# Altium project 7797-20-0224.PrjPcb
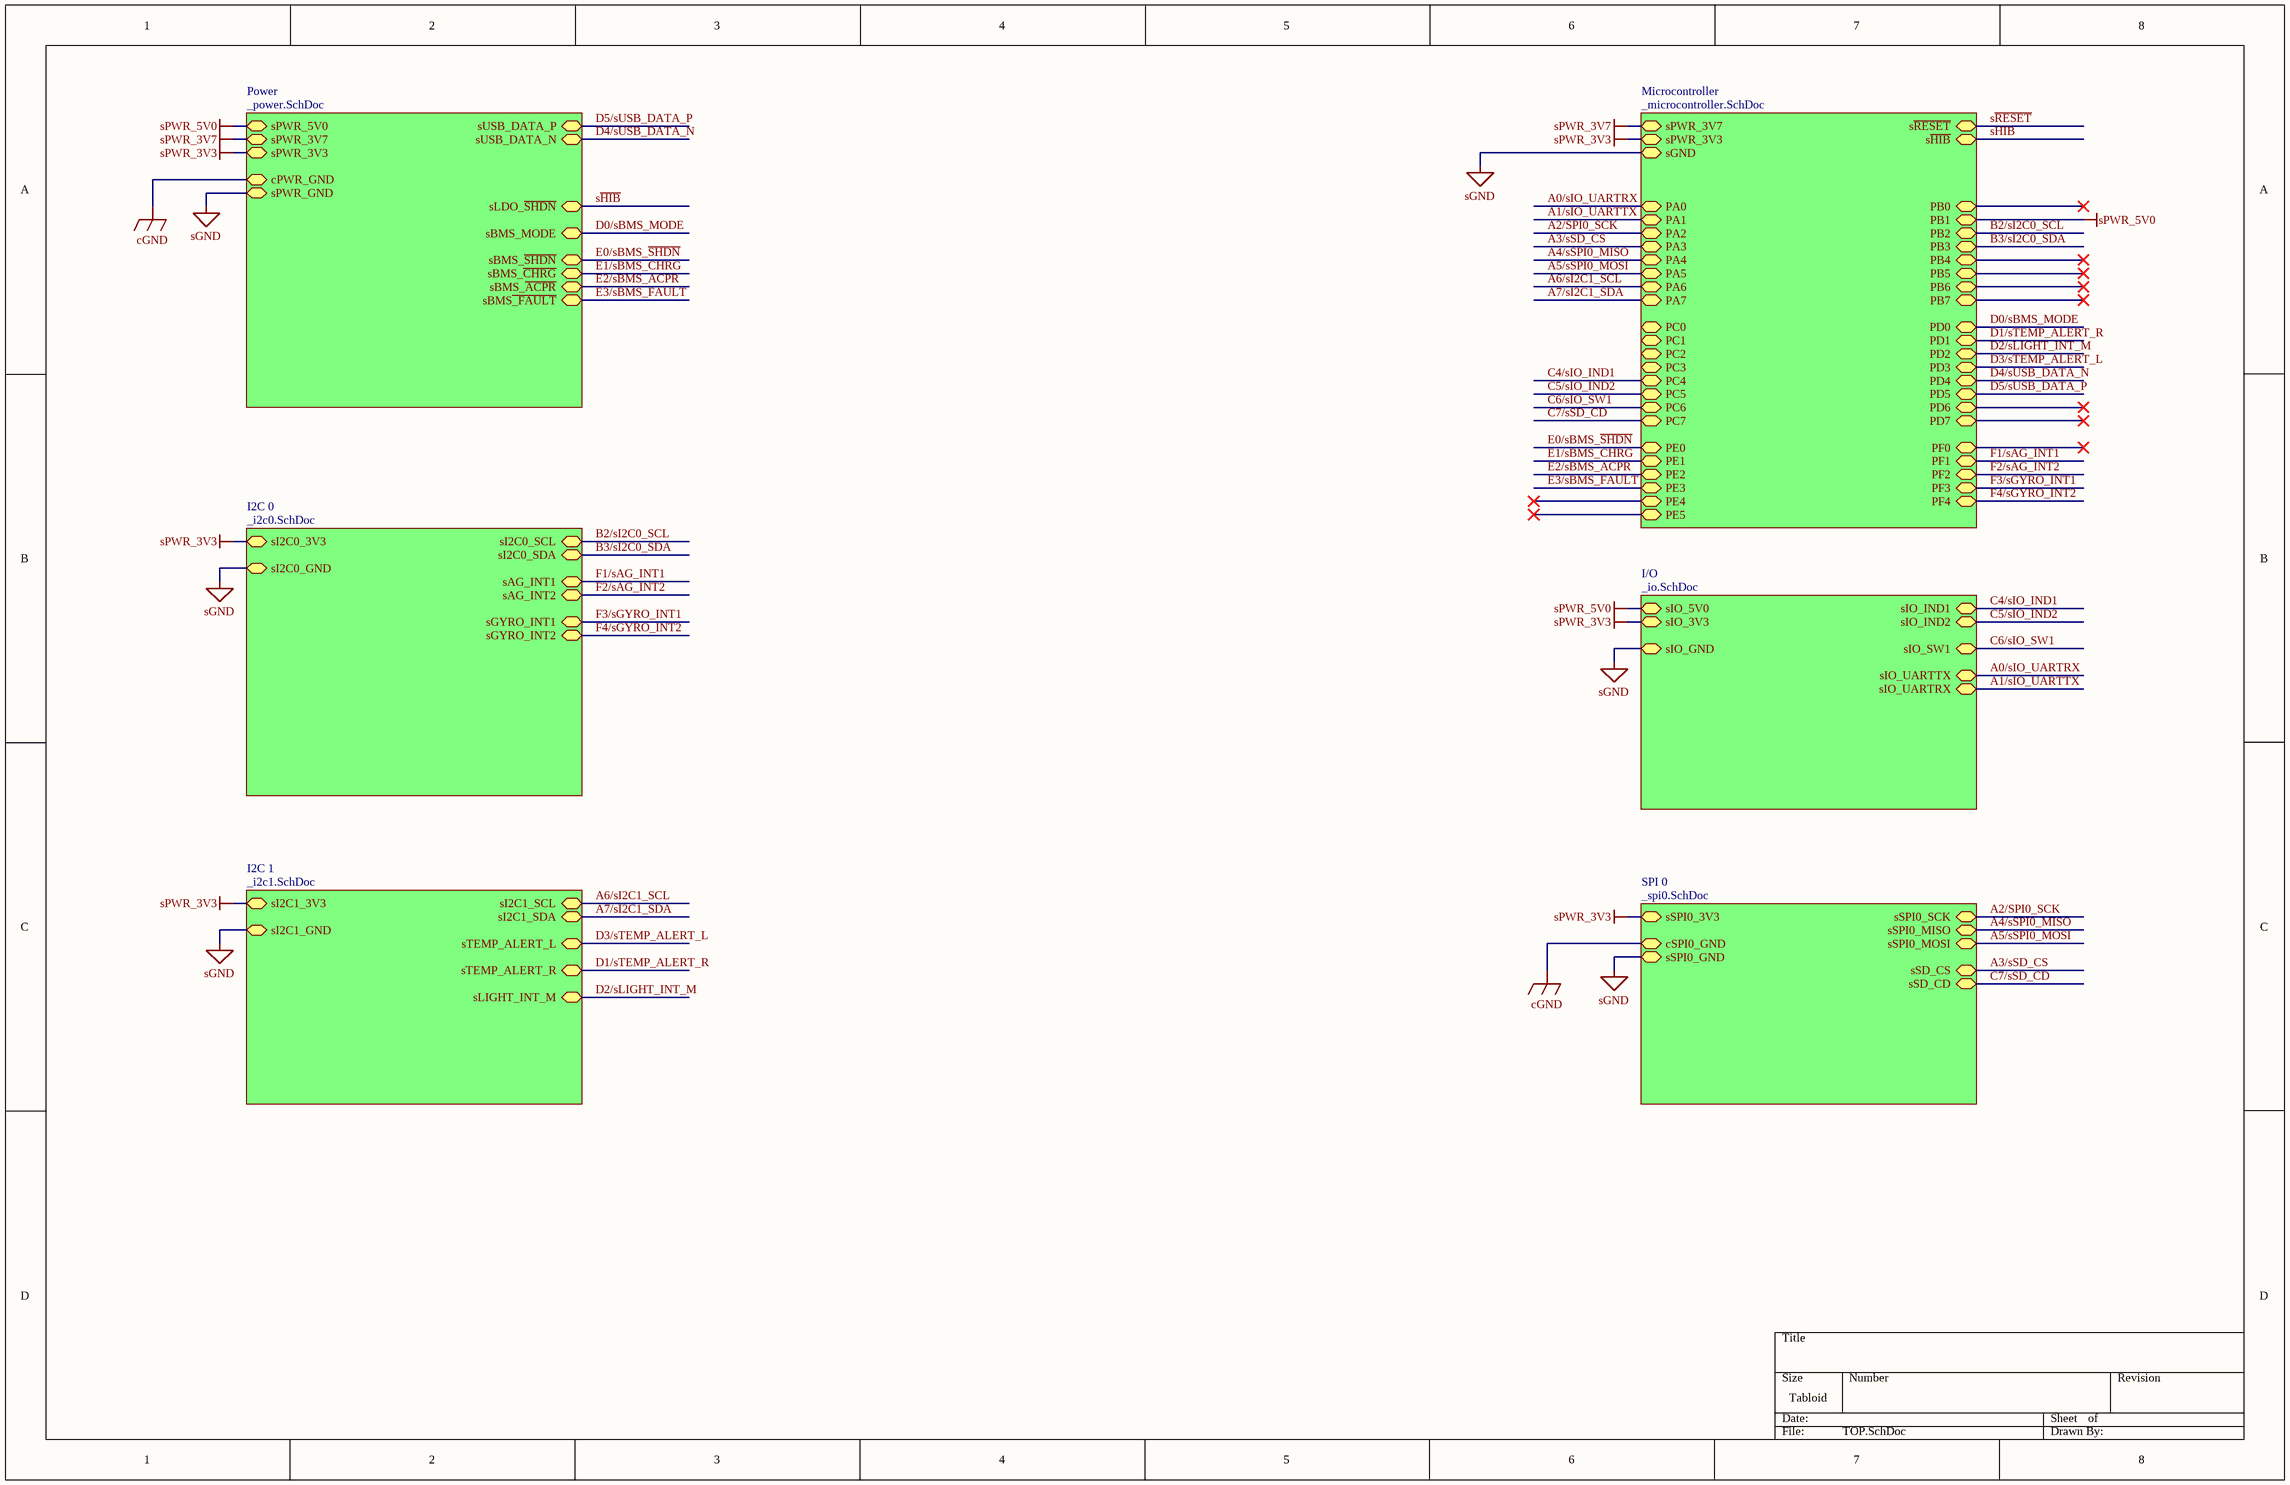
[diagram p0: TOP.SchDoc]
12 sheets, 119 parts. Net scope: strictly hierarchical (ports join the sheet entries above them; power ports are local).
Board file: 7797-20-0224.PcbDoc
Sheets:
  TOP.SchDoc
    Microcontroller = _microcontroller.SchDoc
    Power = _power.SchDoc
    I2C 0 = _i2c0.SchDoc
      Accelerometer and Mangnetometer = _accel_mag.SchDoc
      Gyroscope = _gyroscope.SchDoc
    I2C 1 = _i2c1.SchDoc
      Temperature = _temperature.SchDoc
      Light = _light.SchDoc
      Humidity = _humidity.SchDoc
      Temperature = _temperature.SchDoc
    I/O = _io.SchDoc
  _microsd.SchDoc

## Sheet TOP.SchDoc
size Tabloid

### Sub-sheets
I2C 0 = _i2c0.SchDoc: sI2C0_3V3, sI2C0_GND, sI2C0_SCL, sI2C0_SDA, sAG_INT1, sAG_INT2, sGYRO_INT1, sGYRO_INT2
I2C 1 = _i2c1.SchDoc: sI2C1_3V3, sI2C1_GND, sI2C1_SCL, sI2C1_SDA, sTEMP_ALERT_L, sLIGHT_INT_M, sTEMP_ALERT_R
I/O = _io.SchDoc: sIO_3V3, sIO_GND, sIO_IND1, sIO_IND2, sIO_SW1, sIO_5V0, sIO_UARTTX, sIO_UARTRX
Microcontroller = _microcontroller.SchDoc: s~{RESET}, PA0, PA1, PA2, PA3, PA4, PA5, PA6, PA7, PC0, PC1, PC2, PC3, PC4, PC5, PC6, PC7, PE0, PE1, PE2, PE3, PE4, PE5, PB0, PB1, PB2, PB3, PB4, PB5, PB6, PB7, PD0, PD1, PD2, PD3, PD4, PD5, PD6, PD7, PF0, PF1, PF2, PF3, PF4, sGND, sPWR_3V3, s~{HIB}, sPWR_3V7
Power = _power.SchDoc: sUSB_DATA_P, sUSB_DATA_N, sPWR_3V7, sPWR_3V3, sPWR_GND, cPWR_GND, sPWR_5V0, sLDO_~{SHDN}, sBMS_MODE, sBMS_~{SHDN}, sBMS_~{CHRG}, sBMS_~{ACPR}, sBMS~{_FAULT}
SPI 0 = _spi0.SchDoc (file not in this document): sSPI0_3V3, sSPI0_GND, sSPI0_MISO, sSPI0_MOSI, sSPI0_SCK, cSPI0_GND, sSD_CS, sSD_CD

### Nets
cGND: sheet Power/cPWR_GND, sheet SPI 0/cSPI0_GND
sGND: sheet Microcontroller/sGND, sheet Power/sPWR_GND, sheet I2C 0/sI2C0_GND, sheet I2C 1/sI2C1_GND, sheet I/O/sIO_GND, sheet SPI 0/sSPI0_GND
sPWR_3V3: sheet Microcontroller/sPWR_3V3, sheet Power/sPWR_3V3, sheet I2C 0/sI2C0_3V3, sheet I2C 1/sI2C1_3V3, sheet I/O/sIO_3V3, sheet SPI 0/sSPI0_3V3
sPWR_3V7: sheet Microcontroller/sPWR_3V7, sheet Power/sPWR_3V7
sPWR_5V0: sheet Microcontroller/PB1, sheet Power/sPWR_5V0, sheet I/O/sIO_5V0
A0/sIO_UARTRX: sheet Microcontroller/PA0, sheet I/O/sIO_UARTTX
A1/sIO_UARTTX: sheet Microcontroller/PA1, sheet I/O/sIO_UARTRX
A2/SPI0_SCK: sheet Microcontroller/PA2, sheet SPI 0/sSPI0_SCK
A3/sSD_CS: sheet Microcontroller/PA3, sheet SPI 0/sSD_CS
A4/sSPI0_MISO: sheet Microcontroller/PA4, sheet SPI 0/sSPI0_MISO
A5/sSPI0_MOSI: sheet Microcontroller/PA5, sheet SPI 0/sSPI0_MOSI
A6/sI2C1_SCL: sheet Microcontroller/PA6, sheet I2C 1/sI2C1_SCL
A7/sI2C1_SDA: sheet Microcontroller/PA7, sheet I2C 1/sI2C1_SDA
B2/sI2C0_SCL: sheet Microcontroller/PB2, sheet I2C 0/sI2C0_SCL
B3/sI2C0_SDA: sheet Microcontroller/PB3, sheet I2C 0/sI2C0_SDA
C4/sIO_IND1: sheet Microcontroller/PC4, sheet I/O/sIO_IND1
C5/sIO_IND2: sheet Microcontroller/PC5, sheet I/O/sIO_IND2
C6/sIO_SW1: sheet Microcontroller/PC6, sheet I/O/sIO_SW1
C7/sSD_CD: sheet Microcontroller/PC7, sheet SPI 0/sSD_CD
D0/sBMS_MODE: sheet Microcontroller/PD0, sheet Power/sBMS_MODE
D1/sTEMP_ALERT_R: sheet Microcontroller/PD1, sheet I2C 1/sTEMP_ALERT_R
D2/sLIGHT_INT_M: sheet Microcontroller/PD2, sheet I2C 1/sLIGHT_INT_M
D3/sTEMP_ALERT_L: sheet Microcontroller/PD3, sheet I2C 1/sTEMP_ALERT_L
D4/sUSB_DATA_N: sheet Microcontroller/PD4, sheet Power/sUSB_DATA_N
D5/sUSB_DATA_P: sheet Microcontroller/PD5, sheet Power/sUSB_DATA_P
E0/sBMS_~{SHDN}: sheet Microcontroller/PE0, sheet Power/sBMS_~{SHDN}
E1/sBMS_~{CHRG}: sheet Microcontroller/PE1, sheet Power/sBMS_~{CHRG}
E2/sBMS_~{ACPR}: sheet Microcontroller/PE2, sheet Power/sBMS_~{ACPR}
E3/sBMS~{_FAULT}: sheet Microcontroller/PE3, sheet Power/sBMS~{_FAULT}
F1/sAG_INT1: sheet Microcontroller/PF1, sheet I2C 0/sAG_INT1
F2/sAG_INT2: sheet Microcontroller/PF2, sheet I2C 0/sAG_INT2
F3/sGYRO_INT1: sheet Microcontroller/PF3, sheet I2C 0/sGYRO_INT1
F4/sGYRO_INT2: sheet Microcontroller/PF4, sheet I2C 0/sGYRO_INT2
s~{HIB}: sheet Microcontroller/s~{HIB}, sheet Power/sLDO_~{SHDN}

## Sheet _microcontroller.SchDoc
size Tabloid
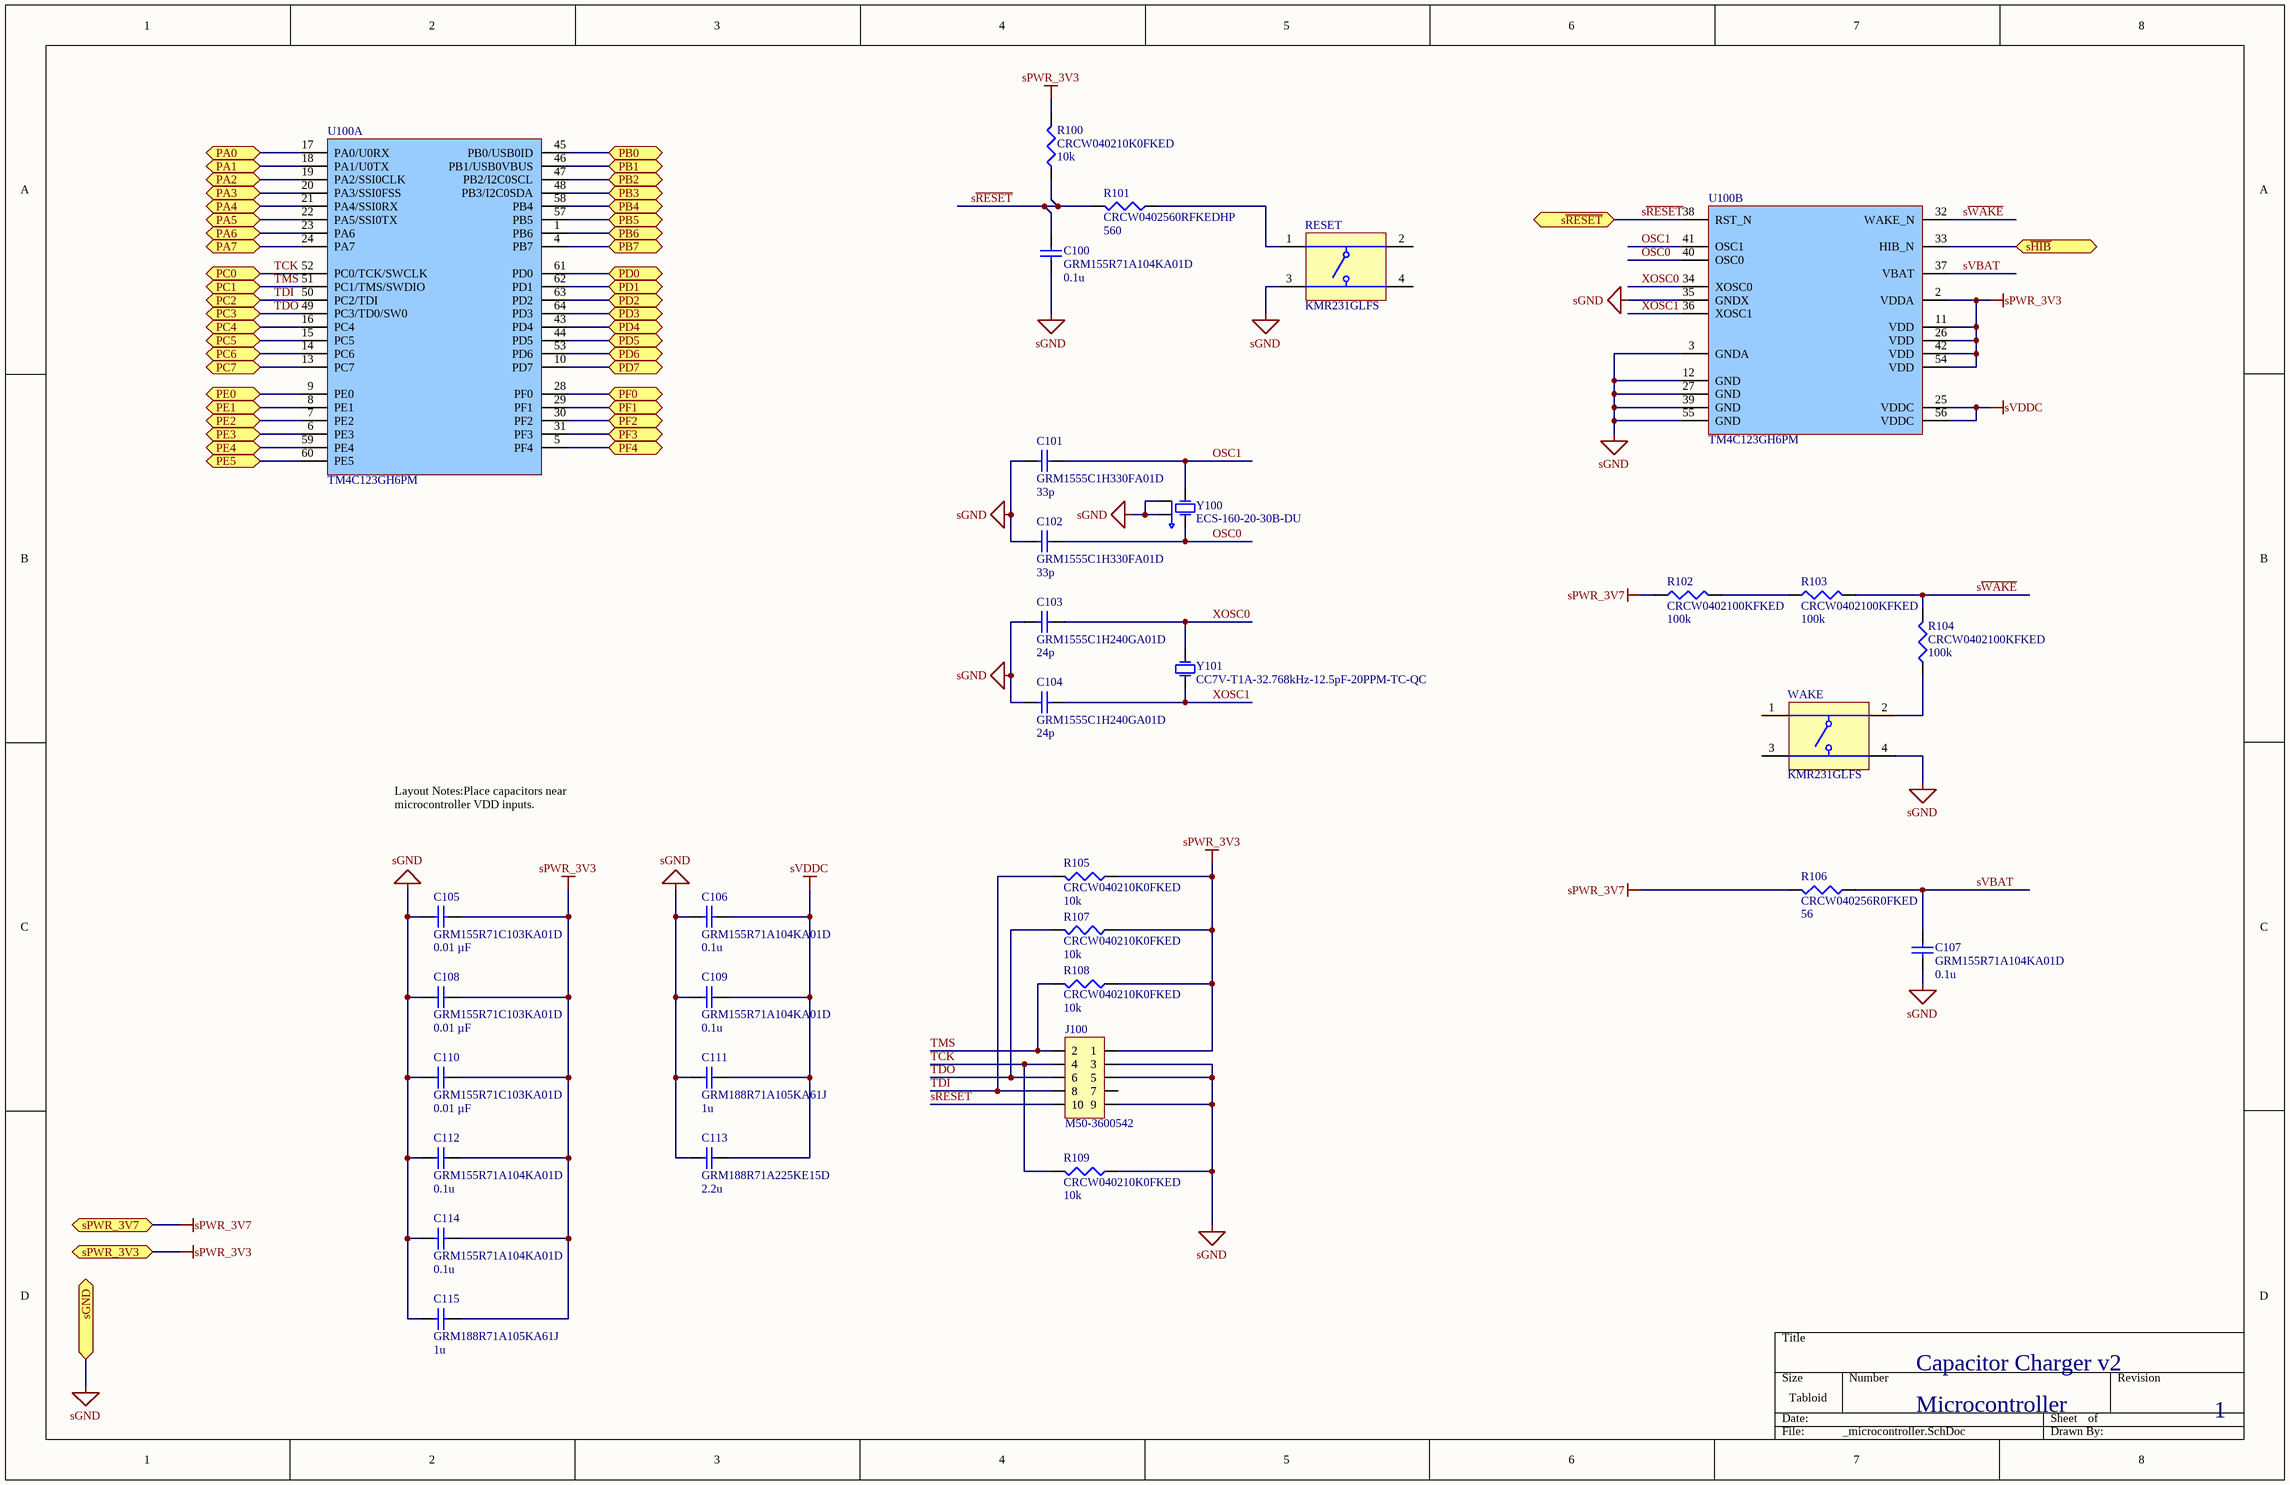
[diagram p1: _microcontroller.SchDoc]

### Parts
C100  GRM155R71A104KA01D  value 0.1u  [0402]
C101  GRM1555C1H330FA01D  value 33p  [0402]
C102  GRM1555C1H330FA01D  value 33p  [0402]
C103  GRM1555C1H240GA01D  value 24p  [0402]
C104  GRM1555C1H240GA01D  value 24p  [0402]
C105  GRM155R71C103KA01D  value 0.01 µF  [0402]
C106  GRM155R71A104KA01D  value 0.1u  [0402]
C107  GRM155R71A104KA01D  value 0.1u  [0402]
C108  GRM155R71C103KA01D  value 0.01 µF  [0402]
C109  GRM155R71A104KA01D  value 0.1u  [0402]
C110  GRM155R71C103KA01D  value 0.01 µF  [0402]
C111  GRM188R71A105KA61J  value 1u  [0603]
C112  GRM155R71A104KA01D  value 0.1u  [0402]
C113  GRM188R71A225KE15D  value 2.2u  [0603]
C114  GRM155R71A104KA01D  value 0.1u  [0402]
C115  GRM188R71A105KA61J  value 1u  [0603]
J100  M50-3600542  [M50-3600542]
R100  CRCW040210K0FKED  value 10k  [0402]
R101  CRCW0402560RFKEDHP  value 560  [0402]
R102  CRCW0402100KFKED  value 100k  [0402]
R103  CRCW0402100KFKED  value 100k  [0402]
R104  CRCW0402100KFKED  value 100k  [0402]
R105  CRCW040210K0FKED  value 10k  [0402]
R106  CRCW040256R0FKED  value 56  [0402]
R107  CRCW040210K0FKED  value 10k  [0402]
R108  CRCW040210K0FKED  value 10k  [0402]
R109  CRCW040210K0FKED  value 10k  [0402]
RESET  KMR231GLFS  [CKCP-KMR231GLFS]
U100  TM4C123GH6PM  [QFP50P1200X1200X160-64N]  (parts A,B of 2)
WAKE  KMR231GLFS  [CKCP-KMR231GLFS]
Y100  ECS-160-20-30B-DU  [ECX-53B]
Y101  CC7V-T1A-32.768kHz-12.5pF-20PPM-TC-QC  [CC7V-T1A]

### Ports
PA0, PA1, PA2, PA3, PA4, PA5, PA6, PA7, PB0, PB1, PB2, PB3, PB4, PB5, PB6, PB7, PC0, PC1, PC2, PC3, PC4, PC5, PC6, PC7, PD0, PD1, PD2, PD3, PD4, PD5, PD6, PD7, PE0, PE1, PE2, PE3, PE4, PE5, PF0, PF1, PF2, PF3, PF4, sGND, sPWR_3V3, sPWR_3V7, s~{HIB}, s~{RESET}

### Nets
sGND: C100.2 C101.1 C102.1 C103.1 C104.1 C105.2 C106.2 C107.2 C108.2 C109.2 C110.2 C111.2 C112.2 C113.2 C114.2 C115.2 J100.3 J100.5 J100.9 R109.1 RESET.3 U100.3(GNDA) U100.12(GND) U100.27(GND) U100.35(GNDX) U100.39(GND) U100.55(GND) WAKE.4 Y100.2 Y100.4 ; port sGND
sPWR_3V3: C105.1 C108.1 C110.1 C112.1 C114.1 C115.1 J100.1 R100.2 R105.1 R107.1 R108.1 U100.2(VDDA) U100.11(VDD) U100.26(VDD) U100.42(VDD) U100.54(VDD) ; port sPWR_3V3
sPWR_3V7: R102.1 R106.2 ; port sPWR_3V7
sPWR_5V0: U100.46(PB1/USB0VBUS) ; port PB1
sVDDC: C106.1 C109.1 C111.1 C113.1 U100.25(VDDC) U100.56(VDDC)
A0/sIO_UARTRX: U100.17(PA0/U0RX) ; port PA0
A1/sIO_UARTTX: U100.18(PA1/U0TX) ; port PA1
A2/SPI0_SCK: U100.19(PA2/SSI0CLK) ; port PA2
A3/sSD_CS: U100.20(PA3/SSI0FSS) ; port PA3
A4/sSPI0_MISO: U100.21(PA4/SSI0RX) ; port PA4
A5/sSPI0_MOSI: U100.22(PA5/SSI0TX) ; port PA5
A6/sI2C1_SCL: U100.23(PA6) ; port PA6
A7/sI2C1_SDA: U100.24(PA7) ; port PA7
B2/sI2C0_SCL: U100.47(PB2/I2C0SCL) ; port PB2
B3/sI2C0_SDA: U100.48(PB3/I2C0SDA) ; port PB3
C4/sIO_IND1: U100.16(PC4) ; port PC4
C5/sIO_IND2: U100.15(PC5) ; port PC5
C6/sIO_SW1: U100.14(PC6) ; port PC6
C7/sSD_CD: U100.13(PC7) ; port PC7
D0/sBMS_MODE: U100.61(PD0) ; port PD0
D1/sTEMP_ALERT_R: U100.62(PD1) ; port PD1
D2/sLIGHT_INT_M: U100.63(PD2) ; port PD2
D3/sTEMP_ALERT_L: U100.64(PD3) ; port PD3
D4/sUSB_DATA_N: U100.43(PD4) ; port PD4
D5/sUSB_DATA_P: U100.44(PD5) ; port PD5
E0/sBMS_~{SHDN}: U100.9(PE0) ; port PE0
E1/sBMS_~{CHRG}: U100.8(PE1) ; port PE1
E2/sBMS_~{ACPR}: U100.7(PE2) ; port PE2
E3/sBMS~{_FAULT}: U100.6(PE3) ; port PE3
F1/sAG_INT1: U100.29(PF1) ; port PF1
F2/sAG_INT2: U100.30(PF2) ; port PF2
F3/sGYRO_INT1: U100.31(PF3) ; port PF3
F4/sGYRO_INT2: U100.5(PF4) ; port PF4
OSC0: C102.2 U100.40(OSC0) Y100.3
OSC1: C101.2 U100.41(OSC1) Y100.1
s~{HIB}: U100.33(HIB_N) ; port s~{HIB}
s~{RESET}: C100.1 J100.10 R100.1 R101.2 U100.38(RST_N) ; port s~{RESET}
sVBAT: C107.1 R106.1 U100.37(VBAT)
s~{WAKE}: R103.2 R104.2 U100.32(WAKE_N)
TCK: J100.4 R109.2 U100.52(PC0/TCK/SWCLK) ; port PC0
TDI: J100.8 R105.2 U100.50(PC2/TDI) ; port PC2
TDO: J100.6 R107.2 U100.49(PC3/TD0/SW0) ; port PC3
TMS: J100.2 R108.2 U100.51(PC1/TMS/SWDIO) ; port PC1
XOSC0: C103.2 U100.34(XOSC0) Y101.1
XOSC1: C104.2 U100.36(XOSC1) Y101.2
NetR101_1: R101.1 RESET.1
NetR102_2: R102.2 R103.1
NetR104_1: R104.1 WAKE.2
NetU100_1: U100.1(PB6) ; port PB6
NetU100_4: U100.4(PB7) ; port PB7
NetU100_10: U100.10(PD7) ; port PD7
NetU100_28: U100.28(PF0) ; port PF0
NetU100_45: U100.45(PB0/USB0ID) ; port PB0
NetU100_53: U100.53(PD6) ; port PD6
NetU100_57: U100.57(PB5) ; port PB5
NetU100_58: U100.58(PB4) ; port PB4
NetU100_59: U100.59(PE4) ; port PE4
NetU100_60: U100.60(PE5) ; port PE5

Not connected (* = marked no-connect by the designer): J100 7; RESET 2 4; WAKE 1 3

### Notes on the sheet
- Layout Notes:Place capacitors near microcontroller VDD inputs.
- Capacitor Charger v2
- Microcontroller
- 1

### Library data of the parts
C100 C106 C107 C109 C112 C114 = GRM155R71AxxxKdddd: -55-125C, 1005, 10V, X7R, ±10%
C101-C104 = Cap Semi: Capacitor (Semiconductor SIM Model); Published: 8-Jun-2000; LatestRevisionDate: 29-May-2009; LatestRevisionNote: IPC-7351 Footprint Added.; PackageReference: C1206; Publisher: Altium Limited; PackageDescription: Chip Capacitor
C105 C108 C110 = Cap: Cap, 0.01 µF, 16 V, X7R; Published: 8-Jun-2000; LatestRevisionDate: 17-Jul-2002; LatestRevisionNote: Re-released for DXP Platform.; PackageReference: RAD-0.3; Publisher: Altium Limited; PackageDescription: Radial Cap, Thru-Hole; 2 Leads; 0.3 in Pin Spacing
C111 C113 C115 = GRM188R71AxxxKdddd: -55-125C, 1608, 10V, X7R, ±10%
R100-R109 = CRCW0402xxxxFKED: 0.125W, -55-155C, 1005, 50V, ±1%
RESET WAKE = CMP-2000-06516-1: Switch Tactile, SPST, 50 mA, 32 V, -40 to 85 degC, 4-Pin SMD, RoHS, Tape and Reel; Manufacturer: C&K Components; Mechanical Life: 150000Cycles; Switch Configuration: N.O.; Actuator Style: Button; Ground Terminal: Yes; Maximum DC Voltage Rating: 32V; Minimum Insulation Resistance: >=1000MOhm; Dielectric Strength: >=250Vrms; Operating Force: 3N; Illumination Type: N/R; Body Orientation: Straight; Contact Rating @ Voltage: 1A; Actuator Length: 0.5mm; Operating Temperature: -40to85C; Electrical Life: N/A; Housing Material: N/A; ECCN: EAR99; Pole Throw Configuration: SPST; Contact Plating: Silver; Dimension: 2.8x4.6x1.9mm; Type: Micro-Miniature; Product Weight: N/A; Package Description: 4-Pin Surface Mount Device, Body 4.6 x 2.8 mm; Actuator Color: N/A; HTS: 8536501199; Mounting Technology: SurfaceMount; Mounting: SurfaceMount,GullWing; Seal Location: N/A; Base Material: N/A; Family: KMR2; Part No: KMR231GLFS; Datasheet Version: 06/2016; Contact Material: Silver; Package Reference: KMR231GLFS; Manufacturer URL: http://www.ckswitches.com/; Maximum AC Voltage Rating: N/A; Datasheet URL: http://www.ck-components.com/media/1479/kmr2.pdf; RoHS: Yes; Seal Description: N/A; Packaging: TapeandReel; Supplier: C&KComponents
U100 = TM4C123GH6PM: Tiva TM4C123GH6PM Microcontroller
Y100 = ECS-160-20-30B-DU: Crystal, 16.000MHz, 20pF, 100ppm, -55 to 125 C, 60 Ω
Y101 = CC7V-T1A: Crystals 32.768 kHz 12.5 pF +/-20 PPM -55/+125C

## Sheet _power.SchDoc
size Tabloid
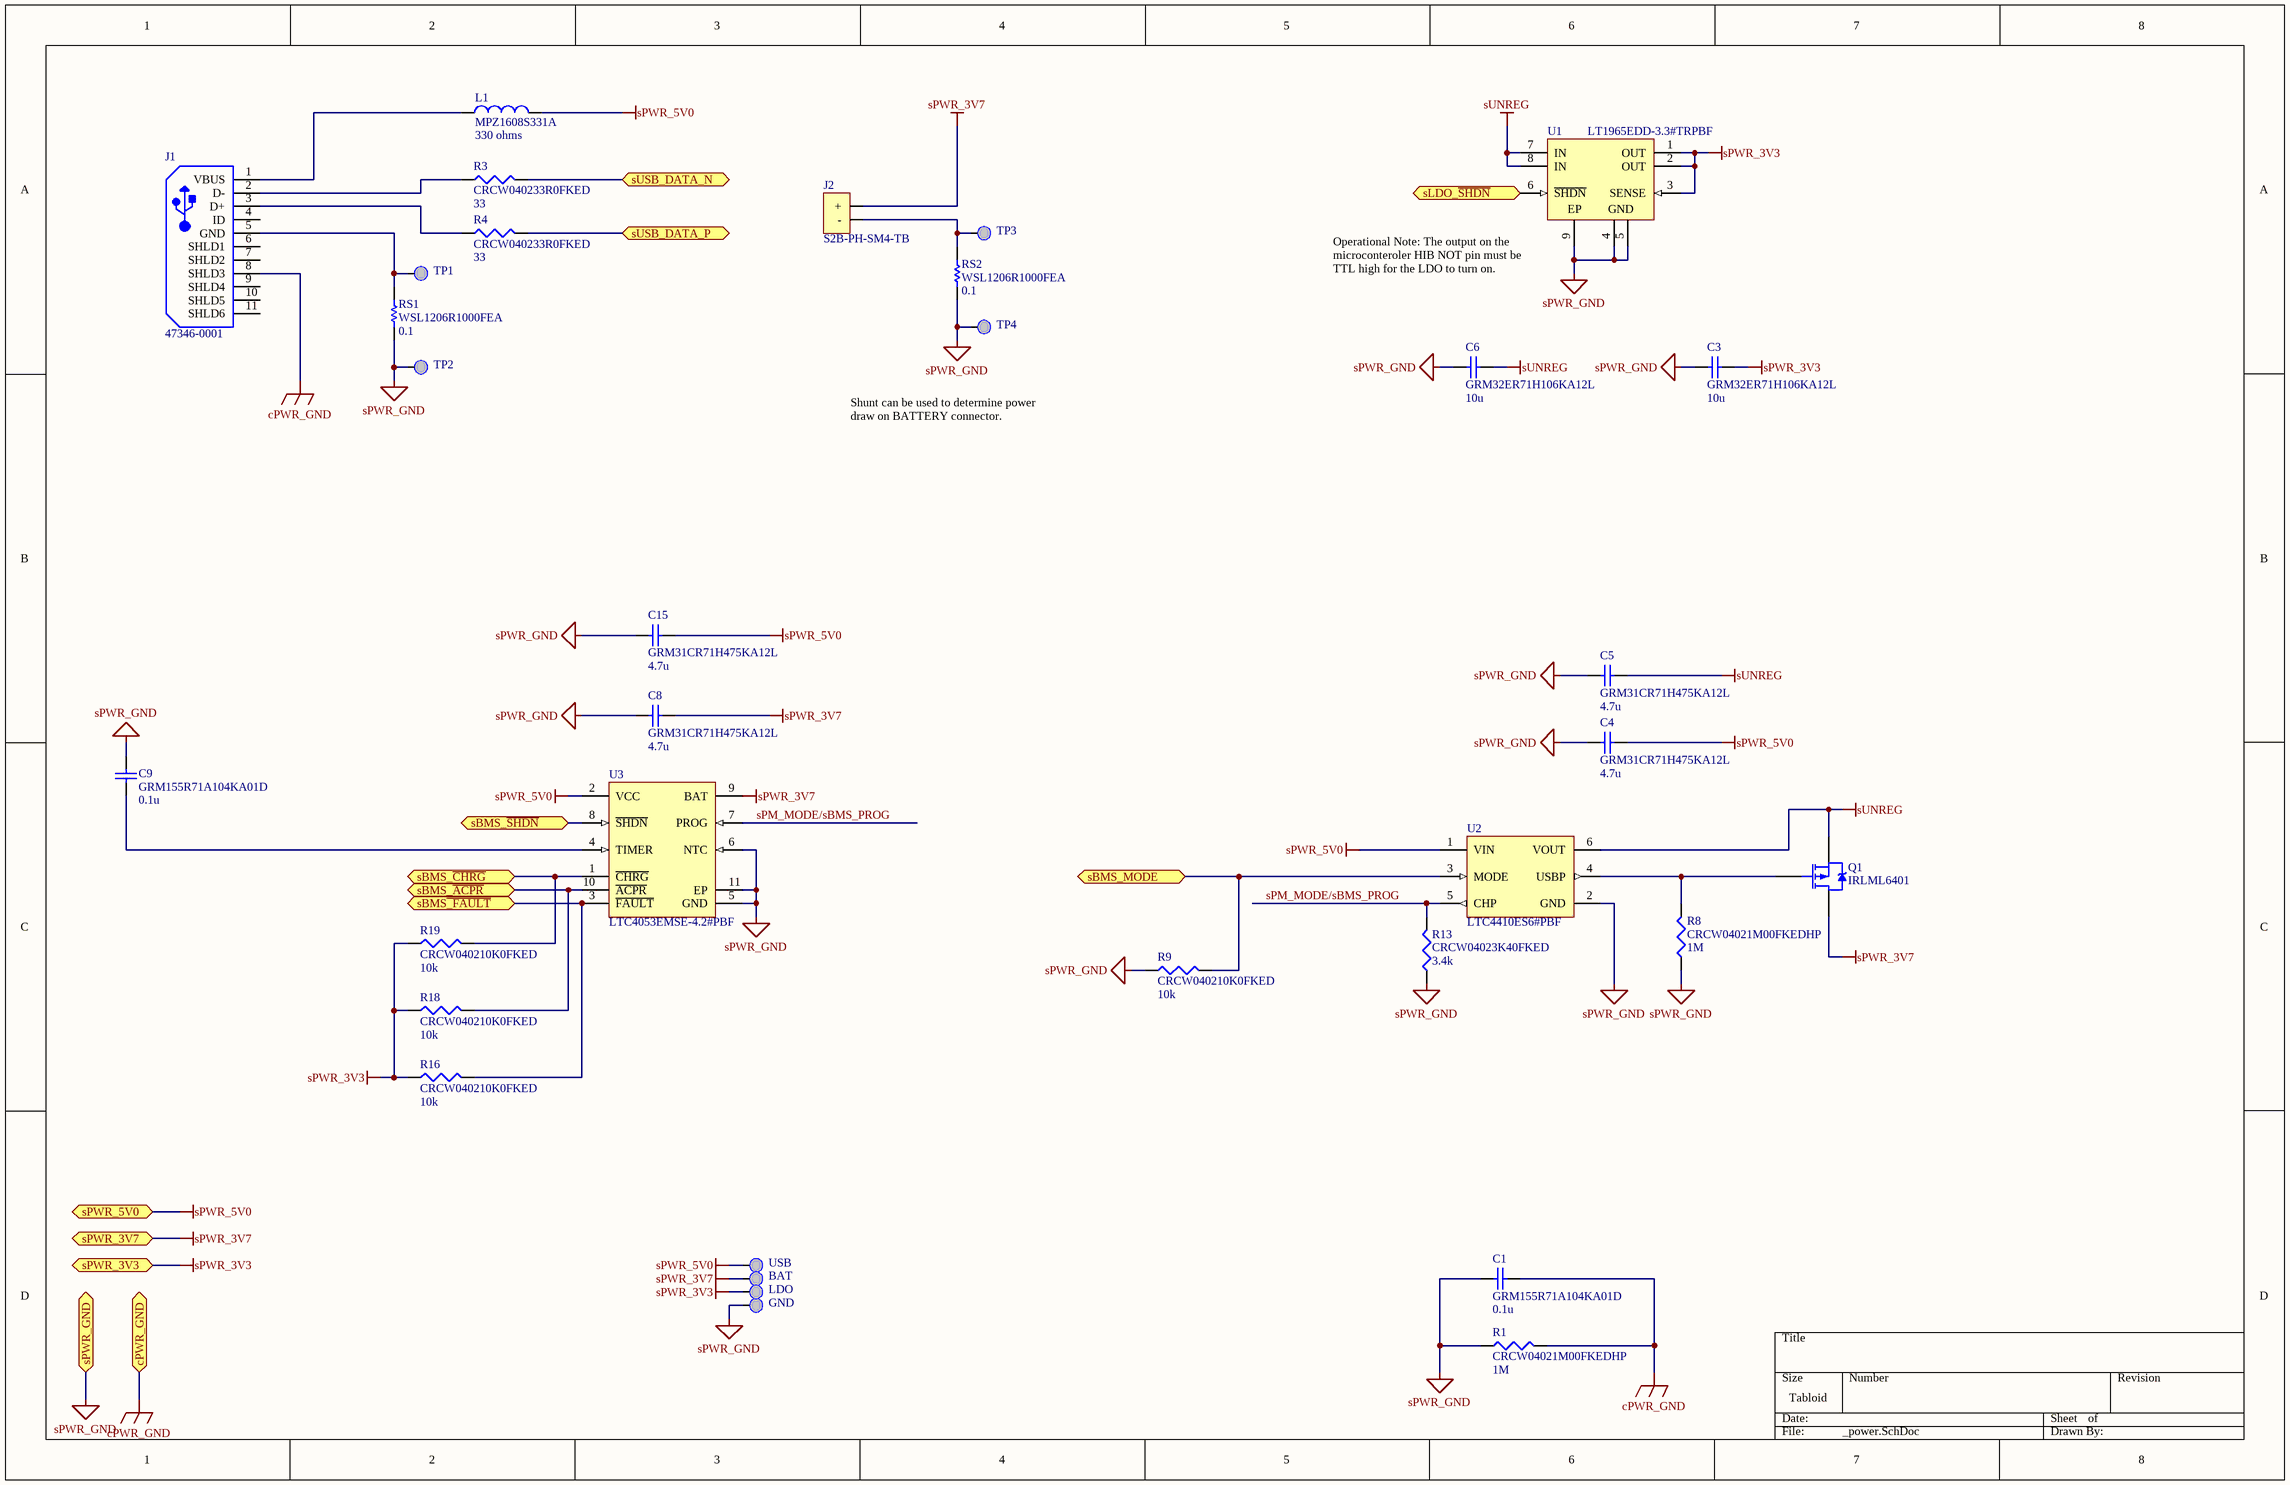
[diagram p2: _power.SchDoc]

### Parts
BAT  TP  [TP_TH]  (value not drawn)
C1  GRM155R71A104KA01D  value 0.1u  [0402]
C3  GRM32ER71H106KA12L  value 10u  [1210]
C4  GRM31CR71H475KA12L  value 4.7u  [1206]
C5  GRM31CR71H475KA12L  value 4.7u  [1206]
C6  GRM32ER71H106KA12L  value 10u  [1210]
C8  GRM31CR71H475KA12L  value 4.7u  [1206]
C9  GRM155R71A104KA01D  value 0.1u  [0402]
C15  GRM31CR71H475KA12L  value 4.7u  [1206]
GND  TP  [TP_TH]  (value not drawn)
J1  47346-0001  [MOLX-47346-0001-5_V]
J2  S2B-PH-SM4-TB  [S2B-PH-SM4-TB]
L1  MPZ1608S331A  value 330 ohms  [1608[0603]]
LDO  TP  [TP_TH]  (value not drawn)
Q1  IRLML6401  [Micro3_N]
R1  CRCW04021M00FKEDHP  value 1M  [0402]
R3  CRCW040233R0FKED  value 33  [0402]
R4  CRCW040233R0FKED  value 33  [0402]
R8  CRCW04021M00FKEDHP  value 1M  [0402]
R9  CRCW040210K0FKED  value 10k  [0402]
R13  CRCW04023K40FKED  value 3.4k  [0402]
R16  CRCW040210K0FKED  value 10k  [0402]
R18  CRCW040210K0FKED  value 10k  [0402]
R19  CRCW040210K0FKED  value 10k  [0402]
RS1  WSL1206R1000FEA  value 0.1  [C1206]
RS2  WSL1206R1000FEA  value 0.1  [C1206]
TP1  TP  [TP_TH]  (value not drawn)
TP2  TP  [TP_TH]  (value not drawn)
TP3  TP  [TP_TH]  (value not drawn)
TP4  TP  [TP_TH]  (value not drawn)
U1  LT1965EDD-3.3#TRPBF  [LT-DD-8_V]
U2  LTC4410ES6#PBF  [LT-S6-6-TSOT-23_N]
U3  LTC4053EMSE-4.2#PBF  [LT-MSE-10-EDP-2060x1830TP_N]
USB  TP  [TP_TH]  (value not drawn)

### Ports
cPWR_GND, sBMS_MODE, sBMS_~{ACPR}, sBMS_~{CHRG}, sBMS_~{SHDN}, sBMS~{_FAULT}, sLDO_~{SHDN}, sPWR_3V3, sPWR_3V7, sPWR_5V0, sPWR_GND, sUSB_DATA_N, sUSB_DATA_P

### Nets
cPWR_GND: C1.2 J1.8(SHLD3) R1.2 ; port cPWR_GND  [project net cGND]
sPWR_3V3: C3.2 LDO.1 R16.1 R18.1 R19.1 U1.1(OUT) U1.2(OUT) U1.3(SENSE) ; port sPWR_3V3
sPWR_3V7: BAT.1 C8.2 J2.2(+) Q1.3(D) U3.9(BAT) ; port sPWR_3V7
sPWR_5V0: C4.2 C15.2 L1.2 U2.1(VIN) U3.2(VCC) USB.1 ; port sPWR_5V0
sPWR_GND: C1.1 C3.1 C4.1 C5.1 C6.1 C8.1 C9.1 C15.1 GND.1 R1.1 R8.1 R9.1 R13.1 RS1.1 RS2.1 TP2.1 TP4.1 U1.4(GND) U1.5(GND) U1.9(EP) U2.2(GND) U3.5(GND) U3.6(NTC) U3.11(EP) ; port sPWR_GND  [project net sGND]
sUNREG: C5.2 C6.2 Q1.2(S) U1.7(IN) U1.8(IN) U2.6(VOUT)
D0/sBMS_MODE: R9.2 U2.3(MODE) ; port sBMS_MODE
D4/sUSB_DATA_N: R3.2 ; port sUSB_DATA_N
D5/sUSB_DATA_P: R4.2 ; port sUSB_DATA_P
E0/sBMS_~{SHDN}: U3.8(~{SHDN}) ; port sBMS_~{SHDN}
E1/sBMS_~{CHRG}: R19.2 U3.1(~{CHRG}) ; port sBMS_~{CHRG}
E2/sBMS_~{ACPR}: R18.2 U3.10(~{ACPR}) ; port sBMS_~{ACPR}
E3/sBMS~{_FAULT}: R16.2 U3.3(~{FAULT}) ; port sBMS~{_FAULT}
s~{HIB}: U1.6(~{SHDN}) ; port sLDO_~{SHDN}
sPM_MODE/sBMS_PROG: R13.2 U2.5(CHP) U3.7(PROG)
NetC9_2: C9.2 U3.4(TIMER)
NetJ1_1: J1.1(VBUS) L1.1
NetJ1_2: J1.2(D-) R3.1
NetJ1_3: J1.3(D+) R4.1
NetJ1_5: J1.5(GND) RS1.2 TP1.1
NetJ2_1: J2.1(-) RS2.2 TP3.1
NetQ1_1: Q1.1(G) R8.2 U2.4(USBP)

Not connected (* = marked no-connect by the designer): J1 4(ID) 6(SHLD1) 7(SHLD2) 9(SHLD4) 10(SHLD5) 11(SHLD6)

### Notes on the sheet
- (near U1) Operational Note: The output on the microconteroler HIB NOT pin must be TTL high for the LDO to turn on.
- Shunt can be used to determine power draw on BATTERY connector.

### Library data of the parts
C1 C9 = GRM155R71AxxxKdddd: -55-125C, 1005, 10V, X7R, ±10%
C3 C6 = GRM32ER71HxxxKdddd: -55-125C, 1005, 50V, X7R, ±10%
C4 C5 C8 C15 = GRM31CR71HxxxKdddd: -55-125C, 3216, 50V, X7R, ±10%
J1 = CMP-2000-05246-1: Micro-USB B Receptacle with Flange, -30 to 85 degC, 5-Pin SMD, RoHS, Tape and Reel; Manufacturer: Molex; Number of Contacts: 5; Body Orientation: RightAngle; Maximum Voltage Rating: 30VAC; Pitch: 0.65mm; Maximum Current Rating: 1.8/ContactA; Number of Ports: 1; Gender: RCP; Operating Temperature: -30to85C; Part No: 47346-0001; Color: Black; Termination Method: Solder; Contact Plating: GoldOverPalladiumNickelOverNickel; Dimension: 7.8x5.43x2.94mm; Number of Terminals: 5; Datasheet Version: Dec-13; Datasheet URL: https://datasheet.ciiva.com/30075/304740473460001-io-nectors-30075527.pdf; Contact Material: CopperAlloy; RoHS: Yes; Housing Material: LiquidCrystalPolymer; Manufacturer URL: http://www.molex.com/; Packaging: EmbossedTapeandReel; Mounting: SurfaceMount; Type: MicroUSBTypeB
J2 = S2B-PH-SM4-TB: JST Battery Connector
L1 = Inductor: EMI Filter Beads, Chips & Arrays 0603 330ohms 100MHz Rdc 0.08ohms 1.7A; Code_IEC: 1005; Published: 8-Jun-2000; LatestRevisionDate: 29-May-2009; LatestRevisionNote: IPC-7351 Footprint Added.; PackageReference: 0402-A; Publisher: Altium Limited; PackageDescription: Chip Inductor; Code_JEITA: 0402
Q1 = IRLML6401: MOSFET P-CH 12V 4.3A SOT-23; Published: 17-Sep-2003; DatasheetVersion: 2-Jul-2001; PackageVersion: Jul-2001; PackageReference: Micro3; Publisher: Altium Limited; PackageDescription: 3-Pin SOT-23 Package 0.95 mm Pitch, 2.3 mm Lead Span; ComponentLink1Description: Manufacturer Link; ComponentLink1URL: http://www.irf.com/; ComponentLink2Description: Datasheet; ComponentLink2URL: http://www.irf.com/product-info/datasheets/data/IRLML6401.pdf
R1 R3 R4 R8 R9 R13 R16 R18 R19 = CRCW0402xxxxFKED: 0.125W, -55-155C, 1005, 50V, ±1%
RS1 RS2 = Res Semi: Current Sense Resistors - SMD 1/4watt .1ohms 1%; Published: 8-Jun-2000; LatestRevisionDate: 17-Jul-2002; LatestRevisionNote: Re-released for DXP Platform.; PackageReference: AXIAL-0.5; Publisher: Altium Limited; PackageDescription: Axial Device, Thru-Hole; 2 Leads; 0.5 in Pin Spacing
U1 = CMP-0476-00225-1: 1.1 A, Low Noise, Low Dropout Linear Regulator, 1.8 to 20 V Vin, 3.3 V Vout, 8-pin SON (DD-8), -40 to 125 degC, Pb-Free, Tape and Reel; Manufacturer: Linear Technology; Number of Outputs: 1; Iout(mA): 1100; Noise(uV): 40; Dropout Voltage(V): 0.31; Discrete Pass Element: no; Vin Max(V): 20; Output Voltage: 3.3 V; PSRR(dB): 75; Isupply(mA): 0.5; Vin Min(V): 1.8; PackageReference: DD-8; PackageDescription: 8-Pin Plastic DFN, Body 3 x 3 mm, Pitch 0.5 mm; Code_JEDEC: MO-229; ComponentLink2URL: http://cds.linear.com/docs/en/datasheet/1965fa.pdf; PackageVersion: Jun-10; ComponentLink3URL: http://cds.linear.com/docs/en/packaging/DFN_8_05-08-1698.pdf; ComponentLink2Description: Datasheet; Packing: Tape and Reel; Shutdown Current(uA): 1; PartNumber: LT1965EDD-3.3#TRPBF; ComponentLink1URL: http://www.linear.com/; RoHS: TRUE; Mounting Technology: Surface Mount; ComponentLink3Description: Package Specification; ComponentLink1Description: Manufacturer URL; DatasheetVersion: Rev. A
U2 = LTC4410ES6#PBF: USB Power Manager, 4.35 to 5.5 V Vin, 6-pin SOT23 (S6-6), -40 to 85 degC, Pb-Free; Manufacturer: Linear Technology; Ideal Diode: Single, External, P-Channel; PackageVersion: Jun-10; PackageReference: S6-6; PackageDescription: 6-Pin Plastic TSOT-23, Body 2.9 x 1.63 mm, Pitch 0.95 mm; Supplier 1: Newark; Supplier Part Number 1: 78T3424; RoHS: TRUE; Mounting Technology: Surface Mount; Code_JEDEC: MO-193; PartNumber: LTC4410ES6#PBF; ComponentLink1Description: Manufacturer URL; ComponentLink1URL: http://www.linear.com/; ComponentLink2Description: Datasheet; ComponentLink2URL: http://cds.linear.com/docs/en/datasheet/4410fs.pdf; ComponentLink3Description: Package Specification; ComponentLink3URL: http://cds.linear.com/docs/en/packaging/SOT_6_05-08-1636.pdf
U3 = LTC4053EMSE-4.2#PBF: USB Compatible Lithium-Ion Battery Charger with Thermal Regulation, 4.25 to 6.5 V Vin, 10-pin SOP (MSE-10-EDP), -40 to 85 degC, Pb-Free; Manufacturer: Linear Technology; Battery Chemistry: Li-Ion, Li-Polymer; Charge Termination: On-board timer; Float Voltage: 4.2 V; Max Charge Current(A): 1.25; Number of Cells: 1; Type of Charger: Linear; Vin Max(V): 6.5; Vin Min(V): 4.25; DatasheetVersion: Rev. A; PackageVersion: Rev. C, 08/2009; PackageReference: MSE-10; PackageDescription: 10-Pin Plastic MSOP, Exposed Die Pad, Body 3 x 3 mm, Pitch 0.5 mm; Supplier 1: Digi-Key; Supplier Part Number 1: LTC4053EMSE-4.2#PBF-ND; Supplier 2: Farnell; Supplier Part Number 2: 1663727; Supplier 3: Newark; Supplier Part Number 3: 58M0850; RoHS: TRUE; Mounting Technology: Surface Mount; PartNumber: LTC4053EMSE-4.2#PBF; ComponentLink1Description: Manufacturer URL; ComponentLink1URL: http://www.linear.com/; ComponentLink2Description: Datasheet; ComponentLink2URL: http://cds.linear.com/docs/en/datasheet/4053-4.2fs.pdf; ComponentLink3Description: Package Specification; ComponentLink3URL: http://cds.linear.com/docs/en/datasheet/3481fc.pdf

## Sheet _i2c0.SchDoc
size Tabloid
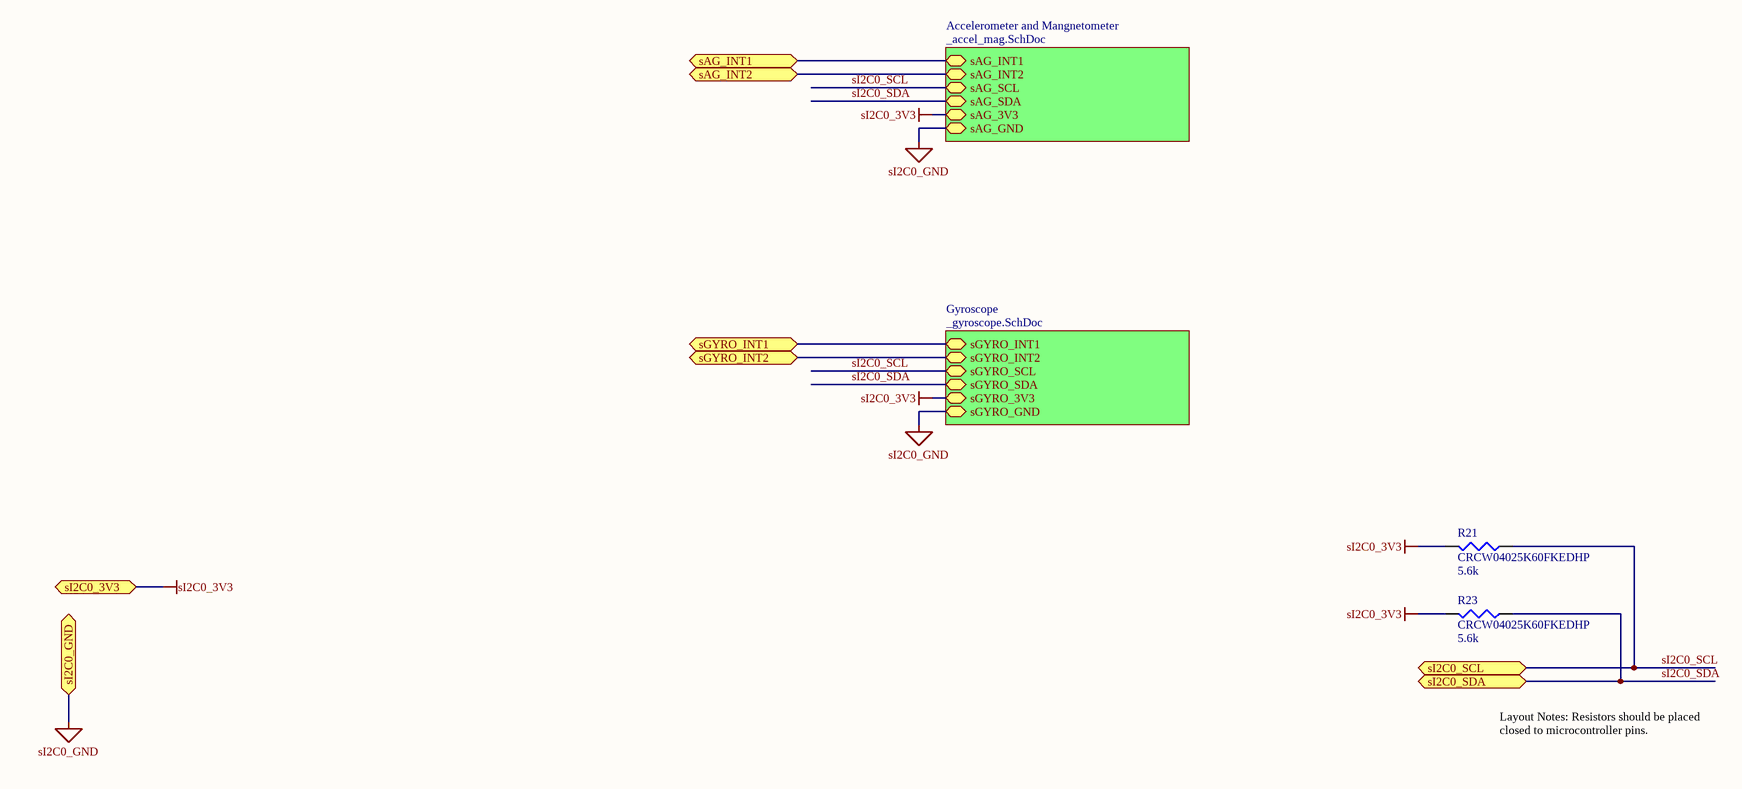
[diagram p3: _i2c0.SchDoc]

### Parts
R21  CRCW04025K60FKEDHP  value 5.6k  [0402]
R23  CRCW04025K60FKEDHP  value 5.6k  [0402]

### Sub-sheets
Accelerometer and Mangnetometer = _accel_mag.SchDoc: sAG_3V3, sAG_GND, sAG_SCL, sAG_SDA, sAG_INT1, sAG_INT2
Gyroscope = _gyroscope.SchDoc: sGYRO_3V3, sGYRO_GND, sGYRO_INT1, sGYRO_INT2, sGYRO_SCL, sGYRO_SDA

### Ports
sAG_INT1, sAG_INT2, sGYRO_INT1, sGYRO_INT2, sI2C0_3V3, sI2C0_GND, sI2C0_SCL, sI2C0_SDA

### Nets
sI2C0_3V3: R21.2 R23.2 ; port sI2C0_3V3, sheet Accelerometer and Mangnetometer/sAG_3V3, sheet Gyroscope/sGYRO_3V3  [project net sPWR_3V3]
sI2C0_GND: port sI2C0_GND, sheet Accelerometer and Mangnetometer/sAG_GND, sheet Gyroscope/sGYRO_GND  [project net sGND]
F1/sAG_INT1: port sAG_INT1, sheet Accelerometer and Mangnetometer/sAG_INT1
F2/sAG_INT2: port sAG_INT2, sheet Accelerometer and Mangnetometer/sAG_INT2
F3/sGYRO_INT1: port sGYRO_INT1, sheet Gyroscope/sGYRO_INT1
F4/sGYRO_INT2: port sGYRO_INT2, sheet Gyroscope/sGYRO_INT2
sI2C0_SCL: R21.1 ; port sI2C0_SCL, sheet Accelerometer and Mangnetometer/sAG_SCL, sheet Gyroscope/sGYRO_SCL  [project net B2/sI2C0_SCL]
sI2C0_SDA: R23.1 ; port sI2C0_SDA, sheet Accelerometer and Mangnetometer/sAG_SDA, sheet Gyroscope/sGYRO_SDA  [project net B3/sI2C0_SDA]

### Notes on the sheet
- Layout Notes: Resistors should be placed closed to microcontroller pins.

### Library data of the parts
R21 R23 = CRCW0402xxxxFKED: 0.125W, -55-155C, 1005, 50V, ±1%

## Sheet _accel_mag.SchDoc
size Tabloid
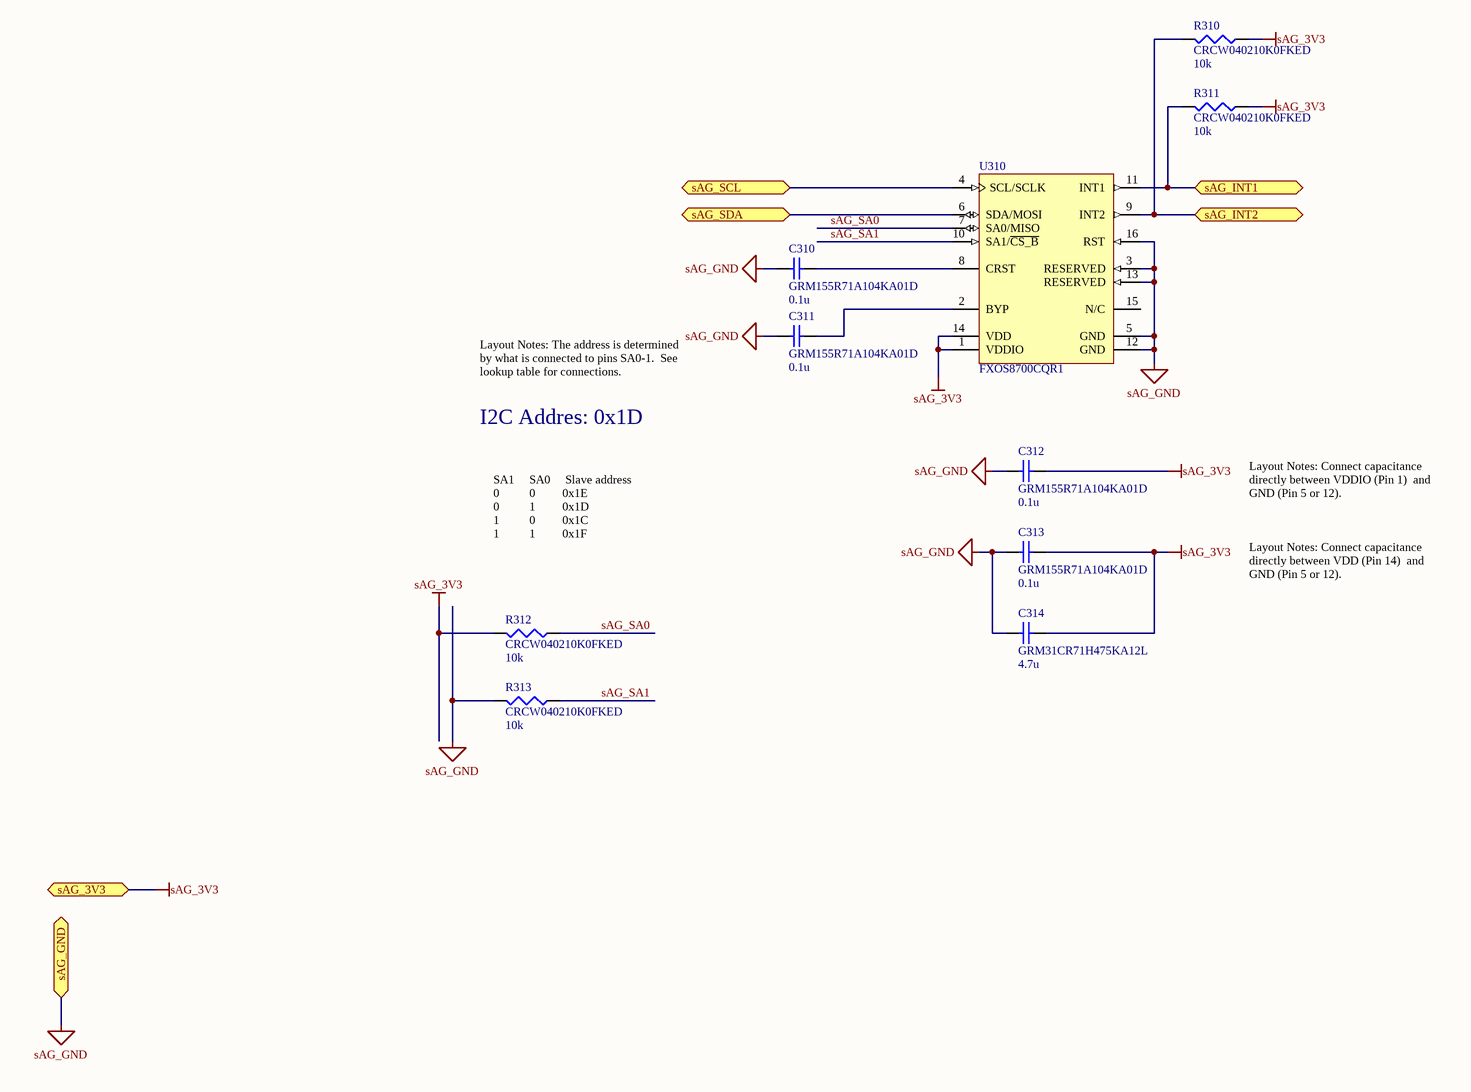
[diagram p4: _accel_mag.SchDoc]

### Parts
C310  GRM155R71A104KA01D  value 0.1u  [0402]
C311  GRM155R71A104KA01D  value 0.1u  [0402]
C312  GRM155R71A104KA01D  value 0.1u  [0402]
C313  GRM155R71A104KA01D  value 0.1u  [0402]
C314  GRM31CR71H475KA12L  value 4.7u  [1206]
R310  CRCW040210K0FKED  value 10k  [0402]
R311  CRCW040210K0FKED  value 10k  [0402]
R312  CRCW040210K0FKED  value 10k  [0402]
R313  CRCW040210K0FKED  value 10k  [0402]
U310  FXOS8700CQR1  [FREE-QFN-16-3000X3000DE_V]

### Ports
sAG_3V3, sAG_GND, sAG_INT1, sAG_INT2, sAG_SCL, sAG_SDA

### Nets
sAG_3V3: C312.2 C313.2 C314.2 R310.1 R311.1 R312.2 U310.1(VDDIO) U310.14(VDD) ; port sAG_3V3  [project net sPWR_3V3]
sAG_GND: C310.2 C311.2 C312.1 C313.1 C314.1 R313.2 U310.3(RESERVED) U310.5(GND) U310.12(GND) U310.13(RESERVED) U310.16(RST) ; port sAG_GND  [project net sGND]
B2/sI2C0_SCL: U310.4(SCL/SCLK) ; port sAG_SCL
B3/sI2C0_SDA: U310.6(SDA/MOSI) ; port sAG_SDA
F1/sAG_INT1: R311.2 U310.11(INT1) ; port sAG_INT1
F2/sAG_INT2: R310.2 U310.9(INT2) ; port sAG_INT2
sAG_SA0: R312.1 U310.7(SA0/MISO)
sAG_SA1: R313.1 U310.10(SA1/~{CS_B})
NetC310_1: C310.1 U310.8(CRST)
NetC311_1: C311.1 U310.2(BYP)

Not connected (* = marked no-connect by the designer): U310 15(N/C)

### Notes on the sheet
- Layout Notes: The address is determined by what is connected to pins SA0-1.  See lookup table for connections.
- I2C Addres: 0x1D
- Layout Notes: Connect capacitance directly between VDDIO (Pin 1)  and GND (Pin 5 or 12).
- SA1     SA0     Slave address
  0          0         0x1E
  0          1         0x1D
  1          0         0x1C
  1          1         0x1F
- Layout Notes: Connect capacitance directly between VDD (Pin 14)  and GND (Pin 5 or 12).

### Library data of the parts
C310-C313 = GRM155R71AxxxKdddd: -55-125C, 1005, 10V, X7R, ±10%
C314 = GRM31CR71HxxxKdddd: -55-125C, 3216, 50V, X7R, ±10%
R310-R313 = CRCW0402xxxxFKED: 0.125W, -55-155C, 1005, 50V, ±1%
U310 = CMP-2000-05129-1: 6-Axis Xtrinsic Sensor with Integrated Linear Accelerometer and Magnetometer, 1.95 to 3.6 V, -40 to 85 degC, 16-Pin QFN, RoHS, Tape and Reel; Manufacturer: Freescale; Supply Voltage - Min: 1.95V; Operating Supply Voltage: 1.95Vto3.6V; Unit Weight: 0.000808oz; Supply Voltage - Max: 3.6V; Brand: FreescaleSemiconductor; Sensing Axis: X,Y,Z; Output Type: Digital; Package / Case: QFN-16; Datasheet Version: Rev. 1, 06/2012; Factory Pack Quantity: 1000; Mounting Style: SMD/SMT; Datasheet URL: https://datasheet.ciiva.com/12175/fxos8700cq-60595-12175213.pdf; Type: 6AxisSensor; Maximum Operating Temperature: +85C; Manufacturer URL: http://www.nxp.com/; Package Description: 16-Pin Quad Flat No-lead Package, Body 3 x 3 mm, Pitch 0.5 mm; RoHS: Details; Package Reference: QFN-16; Tradename: Xtrinsic; Packaging: Reel; Minimum Operating Temperature: -40C; Product Category: BoardMountAccelerationSensors

## Sheet _gyroscope.SchDoc
size Tabloid
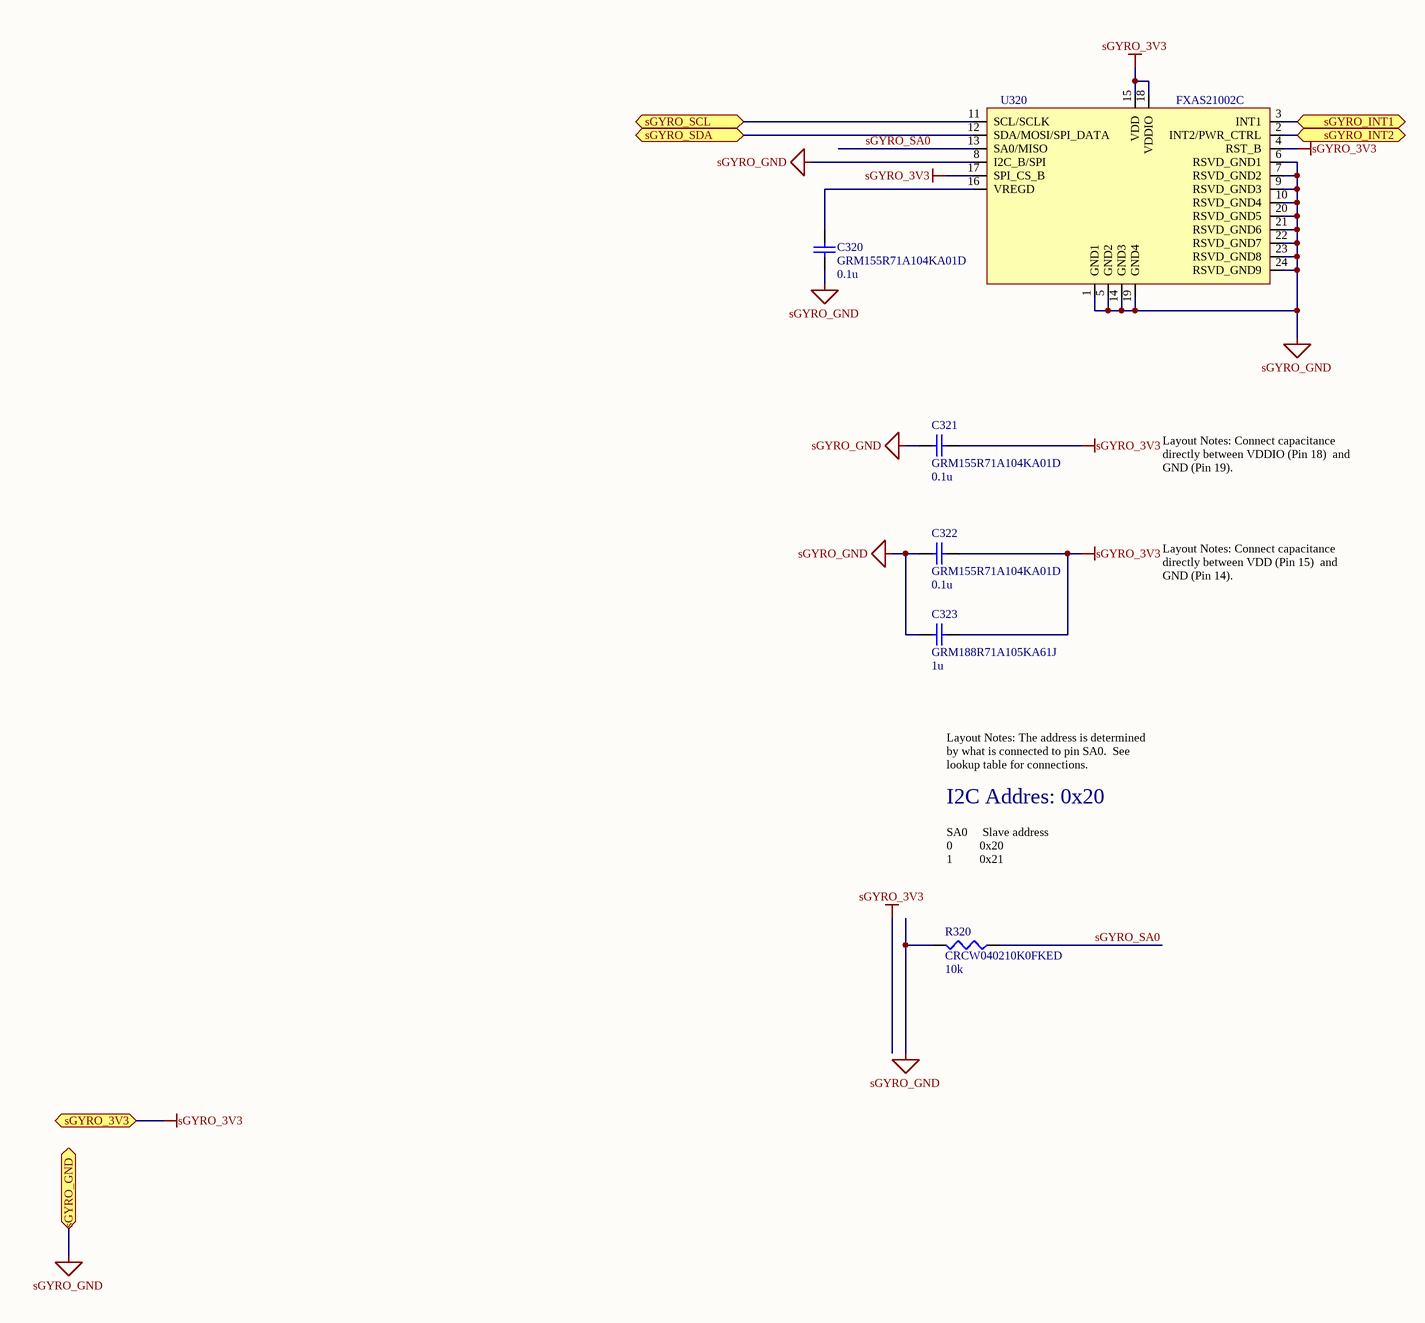
[diagram p5: _gyroscope.SchDoc]

### Parts
C320  GRM155R71A104KA01D  value 0.1u  [0402]
C321  GRM155R71A104KA01D  value 0.1u  [0402]
C322  GRM155R71A104KA01D  value 0.1u  [0402]
C323  GRM188R71A105KA61J  value 1u  [0603]
R320  CRCW040210K0FKED  value 10k  [0402]
U320  FXAS21002C  [SMD QFN 24_4X4MM 7/5]

### Ports
sGYRO_3V3, sGYRO_GND, sGYRO_INT1, sGYRO_INT2, sGYRO_SCL, sGYRO_SDA

### Nets
sGYRO_3V3: C321.2 C322.2 C323.1 U320.4(RST_B) U320.15(VDD) U320.17(SPI_CS_B) U320.18(VDDIO) ; port sGYRO_3V3  [project net sPWR_3V3]
sGYRO_GND: C320.2 C321.1 C322.1 C323.2 R320.2 U320.1(GND1) U320.5(GND2) U320.6(RSVD_GND1) U320.7(RSVD_GND2) U320.8(I2C_B/SPI) U320.9(RSVD_GND3) U320.10(RSVD_GND4) U320.14(GND3) U320.19(GND4) U320.20(RSVD_GND5) U320.21(RSVD_GND6) U320.22(RSVD_GND7) U320.23(RSVD_GND8) U320.24(RSVD_GND9) ; port sGYRO_GND  [project net sGND]
B2/sI2C0_SCL: U320.11(SCL/SCLK) ; port sGYRO_SCL
B3/sI2C0_SDA: U320.12(SDA/MOSI/SPI_DATA) ; port sGYRO_SDA
F3/sGYRO_INT1: U320.3(INT1) ; port sGYRO_INT1
F4/sGYRO_INT2: U320.2(INT2/PWR_CTRL) ; port sGYRO_INT2
sGYRO_SA0: R320.1 U320.13(SA0/MISO)
NetC320_1: C320.1 U320.16(VREGD)

### Notes on the sheet
- Layout Notes: Connect capacitance directly between VDDIO (Pin 18)  and GND (Pin 19).
- Layout Notes: Connect capacitance directly between VDD (Pin 15)  and GND (Pin 14).
- Layout Notes: The address is determined by what is connected to pin SA0.  See lookup table for connections.
- I2C Addres: 0x20
- SA0     Slave address
  0         0x20
  1         0x21

### Library data of the parts
C320-C322 = GRM155R71AxxxKdddd: -55-125C, 1005, 10V, X7R, ±10%
C323 = GRM188R71AxxxKdddd: -55-125C, 1608, 10V, X7R, ±10%
R320 = CRCW0402xxxxFKED: 0.125W, -55-155C, 1005, 50V, ±1%
U320 = FXAS21002C: 3-Axis Digital Angular Rate  Gyroscope

## Sheet _i2c1.SchDoc
size Tabloid
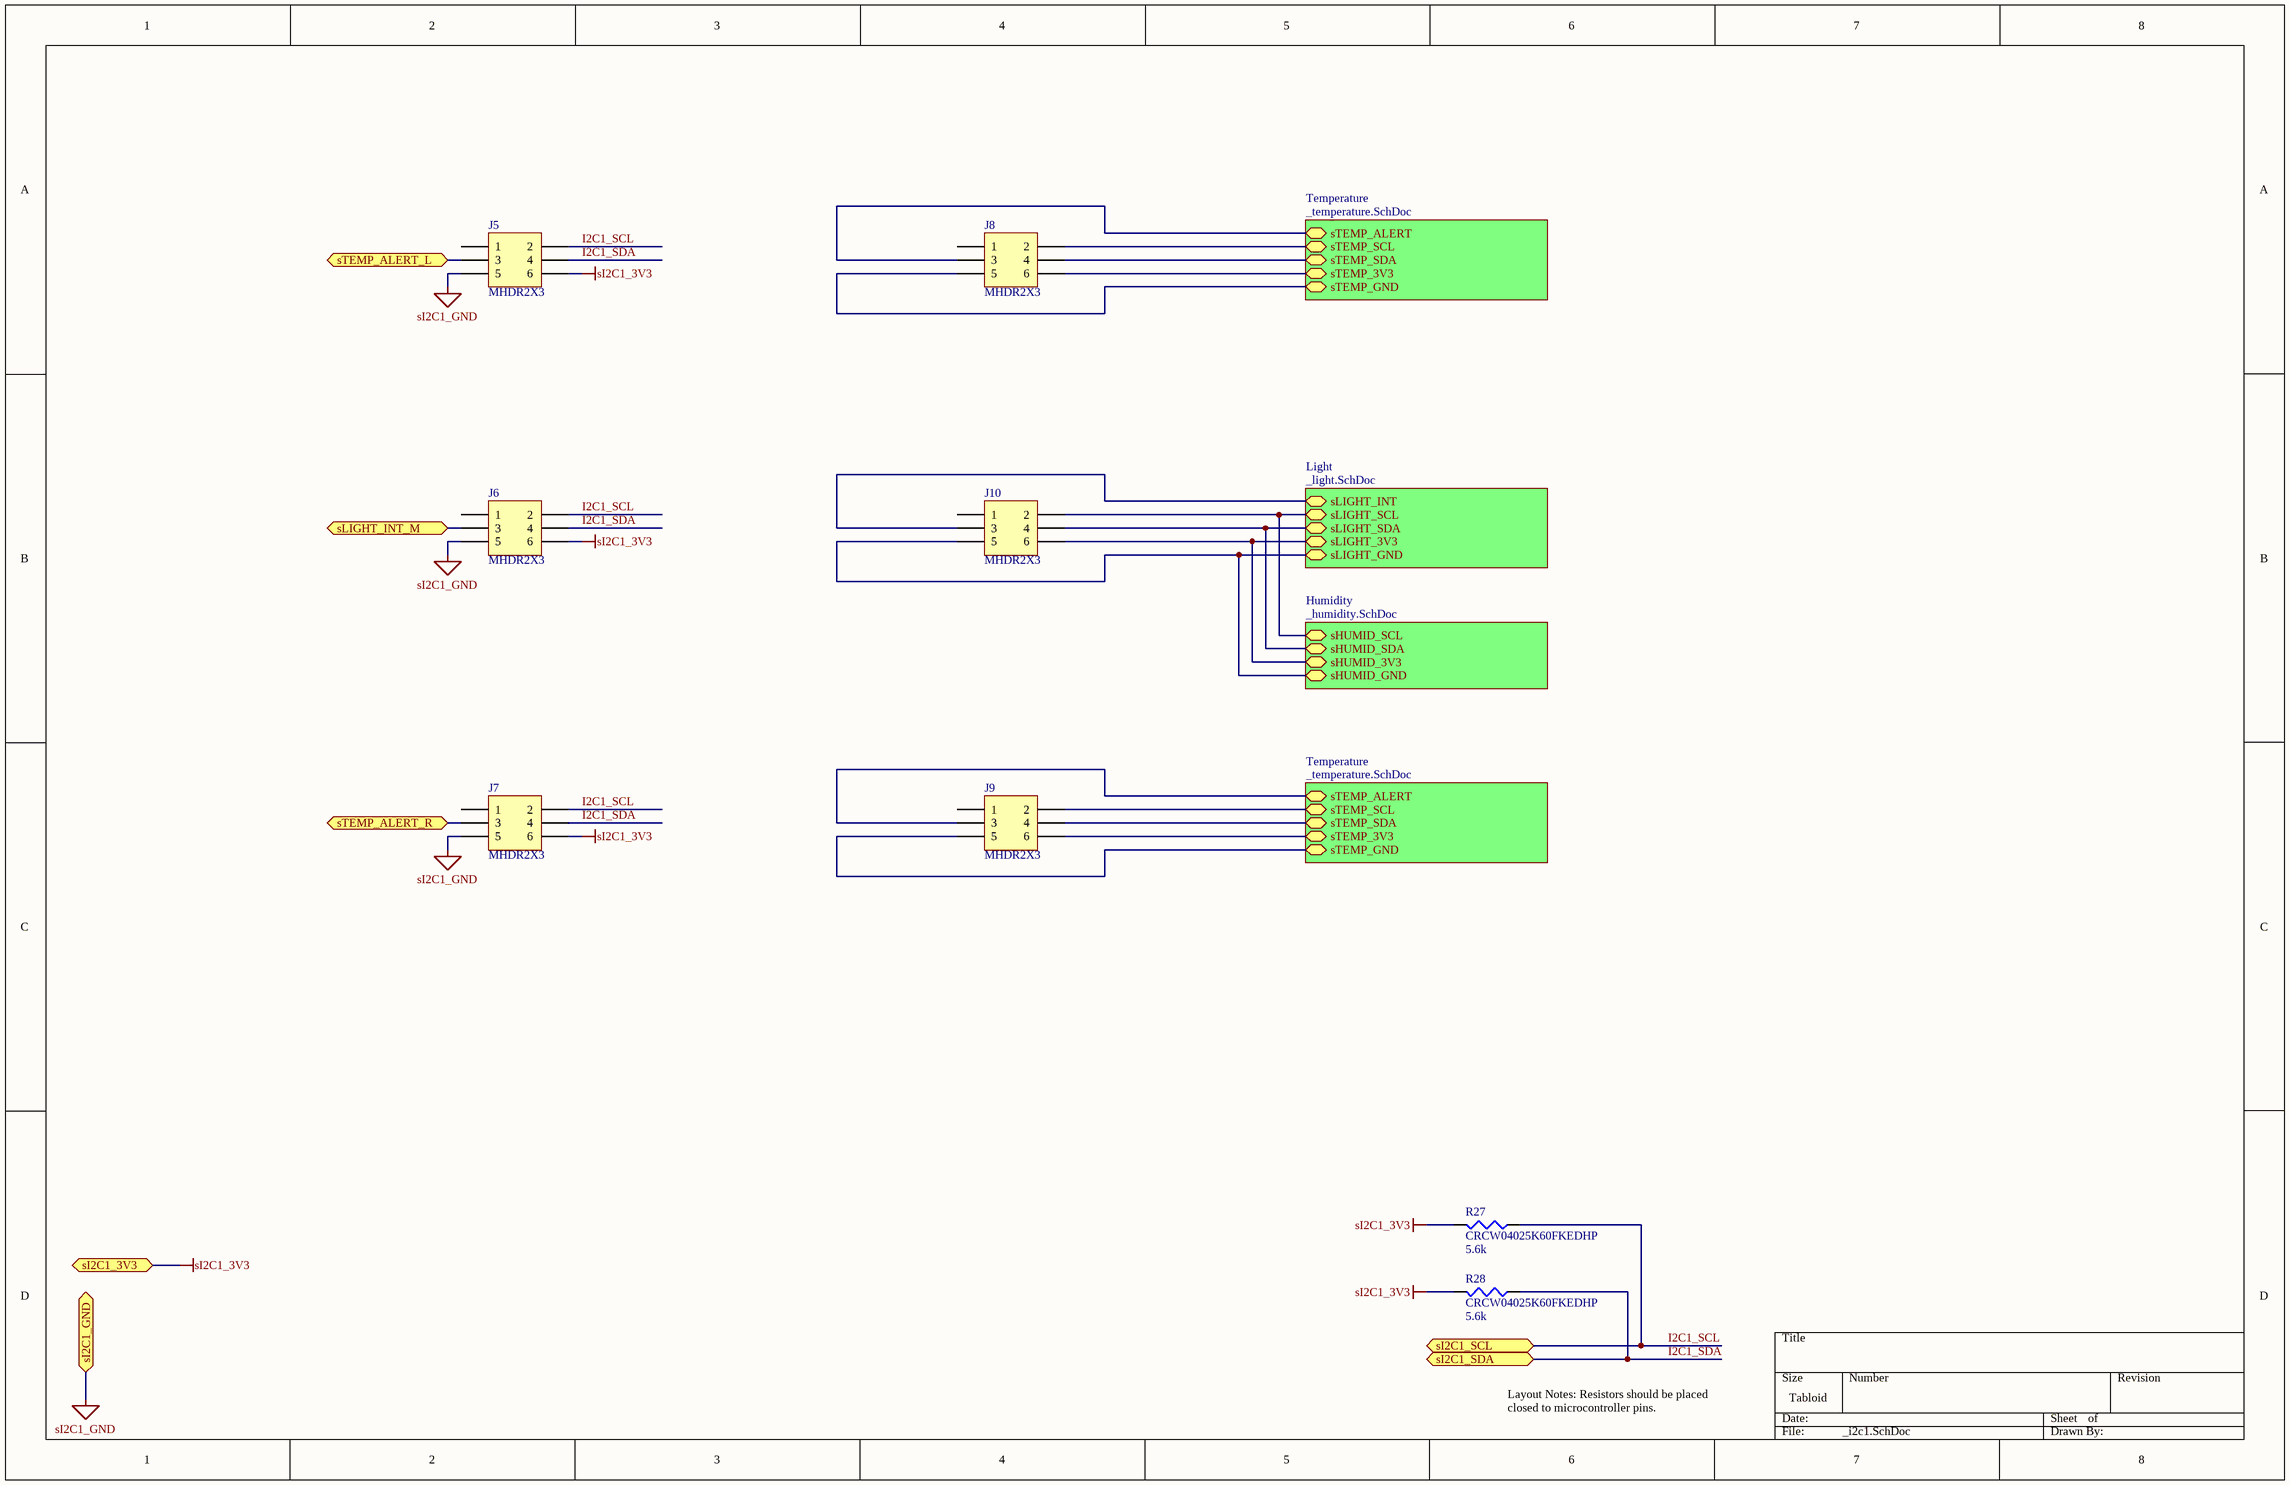
[diagram p6: _i2c1.SchDoc]

### Parts
J5  MHDR2X3  [MHDR2X3]
J6  MHDR2X3  [MHDR2X3]
J7  MHDR2X3  [MHDR2X3]
J8  MHDR2X3  [MHDR2X3]
J9  MHDR2X3  [MHDR2X3]
J10  MHDR2X3  [MHDR2X3]
R27  CRCW04025K60FKEDHP  value 5.6k  [0402]
R28  CRCW04025K60FKEDHP  value 5.6k  [0402]

### Sub-sheets
Humidity = _humidity.SchDoc: sHUMID_SCL, sHUMID_SDA, sHUMID_3V3, sHUMID_GND
Light = _light.SchDoc: sLIGHT_SCL, sLIGHT_SDA, sLIGHT_INT, sLIGHT_3V3, sLIGHT_GND
Temperature = _temperature.SchDoc: sTEMP_3V3, sTEMP_GND, sTEMP_SCL, sTEMP_SDA, sTEMP_ALERT
Temperature = _temperature.SchDoc: sTEMP_3V3, sTEMP_GND, sTEMP_SCL, sTEMP_SDA, sTEMP_ALERT

### Ports
sI2C1_3V3, sI2C1_GND, sI2C1_SCL, sI2C1_SDA, sLIGHT_INT_M, sTEMP_ALERT_L, sTEMP_ALERT_R

### Nets
sHUMID_3V3: J10.6 ; sheet Light/sLIGHT_3V3, sheet Humidity/sHUMID_3V3
sHUMID_GND: J10.5 ; sheet Light/sLIGHT_GND, sheet Humidity/sHUMID_GND
sI2C1_3V3: J5.6 J6.6 J7.6 R27.2 R28.2 ; port sI2C1_3V3  [project net sPWR_3V3]
sI2C1_GND: J5.5 J6.5 J7.5 ; port sI2C1_GND  [project net sGND]
sTEMP_3V3: J8.6 ; sheet Temperature/sTEMP_3V3
sTEMP_3V3: J9.6 ; sheet Temperature/sTEMP_3V3  [a separate net that carries the same name]
sTEMP_GND: J8.5 ; sheet Temperature/sTEMP_GND
sTEMP_GND: J9.5 ; sheet Temperature/sTEMP_GND  [a separate net that carries the same name]
D1/sTEMP_ALERT_R: J7.3 ; port sTEMP_ALERT_R
D2/sLIGHT_INT_M: J6.3 ; port sLIGHT_INT_M
D3/sTEMP_ALERT_L: J5.3 ; port sTEMP_ALERT_L
I2C1_SCL: J5.2 J6.2 J7.2 R27.1 ; port sI2C1_SCL  [project net A6/sI2C1_SCL]
I2C1_SDA: J5.4 J6.4 J7.4 R28.1 ; port sI2C1_SDA  [project net A7/sI2C1_SDA]
NetJ8_2: J8.2 ; sheet Temperature/sTEMP_SCL
NetJ8_3: J8.3 ; sheet Temperature/sTEMP_ALERT
NetJ8_4: J8.4 ; sheet Temperature/sTEMP_SDA
NetJ9_2: J9.2 ; sheet Temperature/sTEMP_SCL
NetJ9_3: J9.3 ; sheet Temperature/sTEMP_ALERT
NetJ9_4: J9.4 ; sheet Temperature/sTEMP_SDA
NetJ10_2: J10.2 ; sheet Light/sLIGHT_SCL, sheet Humidity/sHUMID_SCL
NetJ10_3: J10.3 ; sheet Light/sLIGHT_INT
NetJ10_4: J10.4 ; sheet Light/sLIGHT_SDA, sheet Humidity/sHUMID_SDA

Not connected (* = marked no-connect by the designer): J5 1; J6 1; J7 1; J8 1; J9 1; J10 1

### Notes on the sheet
- Layout Notes: Resistors should be placed closed to microcontroller pins.

### Library data of the parts
J5-J10 = MHDR2X3: Header, 3-Pin, Dual row; LatestRevisionDate: 17-Jul-2002; LatestRevisionNote: Re-released for DXP Platform.; Publisher: Altium Limited
R27 R28 = CRCW0402xxxxFKED: 0.125W, -55-155C, 1005, 50V, ±1%

## Sheet _temperature.SchDoc
size Tabloid
Used 2 times, as channels I2C 1/Temperature, I2C 1/Temperature. Parts and nets are listed once, with the designators drawn on the sheet.
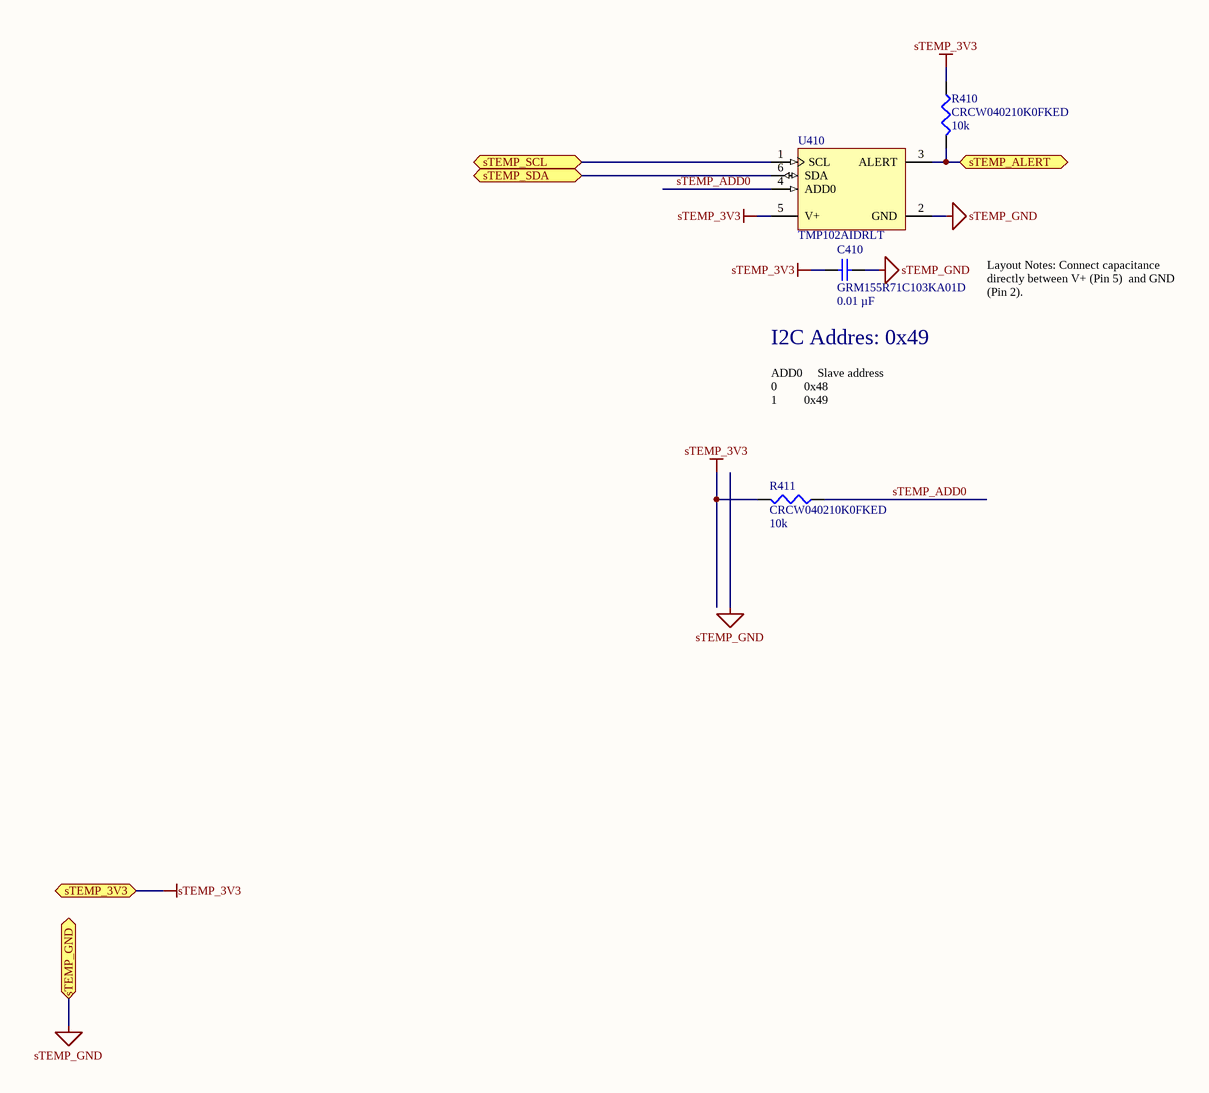
[diagram p7: _temperature.SchDoc]

### Parts
C410  GRM155R71C103KA01D  value 0.01 µF  [0402]
R410  CRCW040210K0FKED  value 10k  [0402]
R411  CRCW040210K0FKED  value 10k  [0402]
U410  TMP102AIDRLT  [DRL0006A_L]

### Ports
sTEMP_3V3, sTEMP_ALERT, sTEMP_GND, sTEMP_SCL, sTEMP_SDA

### Nets
sTEMP_3V3: C410.2 R410.1 R411.2 U410.5(V+) ; port sTEMP_3V3
sTEMP_GND: C410.1 U410.2(GND) ; port sTEMP_GND
sTEMP_ADD0: R411.1 U410.4(ADD0)
sTEMP_ALERT: R410.2 U410.3(ALERT) ; port sTEMP_ALERT
sTEMP_SCL: U410.1(SCL) ; port sTEMP_SCL
sTEMP_SDA: U410.6(SDA) ; port sTEMP_SDA

### Channels
I2C 1/Temperature: designators C410=C37_Temperature2 R410=R36_Temperature2 R411=R34_Temperature2 U410=U9_Temperature2; ports sTEMP_3V3=sTEMP_3V3 sTEMP_ALERT=NetJ8_3 sTEMP_GND=sTEMP_GND sTEMP_SCL=NetJ8_2 sTEMP_SDA=NetJ8_4
I2C 1/Temperature: designators C410=C37_Temperature1 R410=R36_Temperature1 R411=R34_Temperature1 U410=U9_Temperature1; ports sTEMP_3V3=sTEMP_3V3 sTEMP_ALERT=NetJ9_3 sTEMP_GND=sTEMP_GND sTEMP_SCL=NetJ9_2 sTEMP_SDA=NetJ9_4

### Notes on the sheet
- Layout Notes: Connect capacitance directly between V+ (Pin 5)  and GND (Pin 2).
- I2C Addres: 0x49
- ADD0     Slave address
  0         0x48
  1         0x49

### Library data of the parts
C410 = Cap: Cap, 0.01 µF, 16 V, X7R; Published: 8-Jun-2000; LatestRevisionDate: 17-Jul-2002; LatestRevisionNote: Re-released for DXP Platform.; PackageReference: RAD-0.3; Publisher: Altium Limited; PackageDescription: Radial Cap, Thru-Hole; 2 Leads; 0.3 in Pin Spacing
R410 R411 = CRCW0402xxxxFKED: 0.125W, -55-155C, 1005, 50V, ±1%
U410 = CMP-1685-00013-1: Low Power Digital Temperature Sensor with SMBus and Two-Wire Serial Interface, 1.4 to 3.6 V, -40 to 125 degC, 6-Pin SOT (DRL), Green (RoHS & no Sb/Br), Tape and Reel; ComponentLink3URL: http://www.ti.com/lit/ml/mpds159c/mpds159c.pdf; PackageVersion: 4205622-3/D, 08/2207; ComponentLink2Description: Datasheet; PackageReference: DRL0006A; ComponentLink2URL: http://www.ti.com/lit/ds/symlink/tmp102.pdf; ComponentLink3Description: Package Specification; ComponentLink1Description: Manufacturer URL; DatasheetVersion: SBOS397F, 12/2015; PackageDescription: 6-Pin Plastic Small Outline, Body 1.6 x 1.2 mm, Pitch 0.5 mm; ComponentLink1URL: http://www.ti.com/

## Sheet _light.SchDoc
size Tabloid
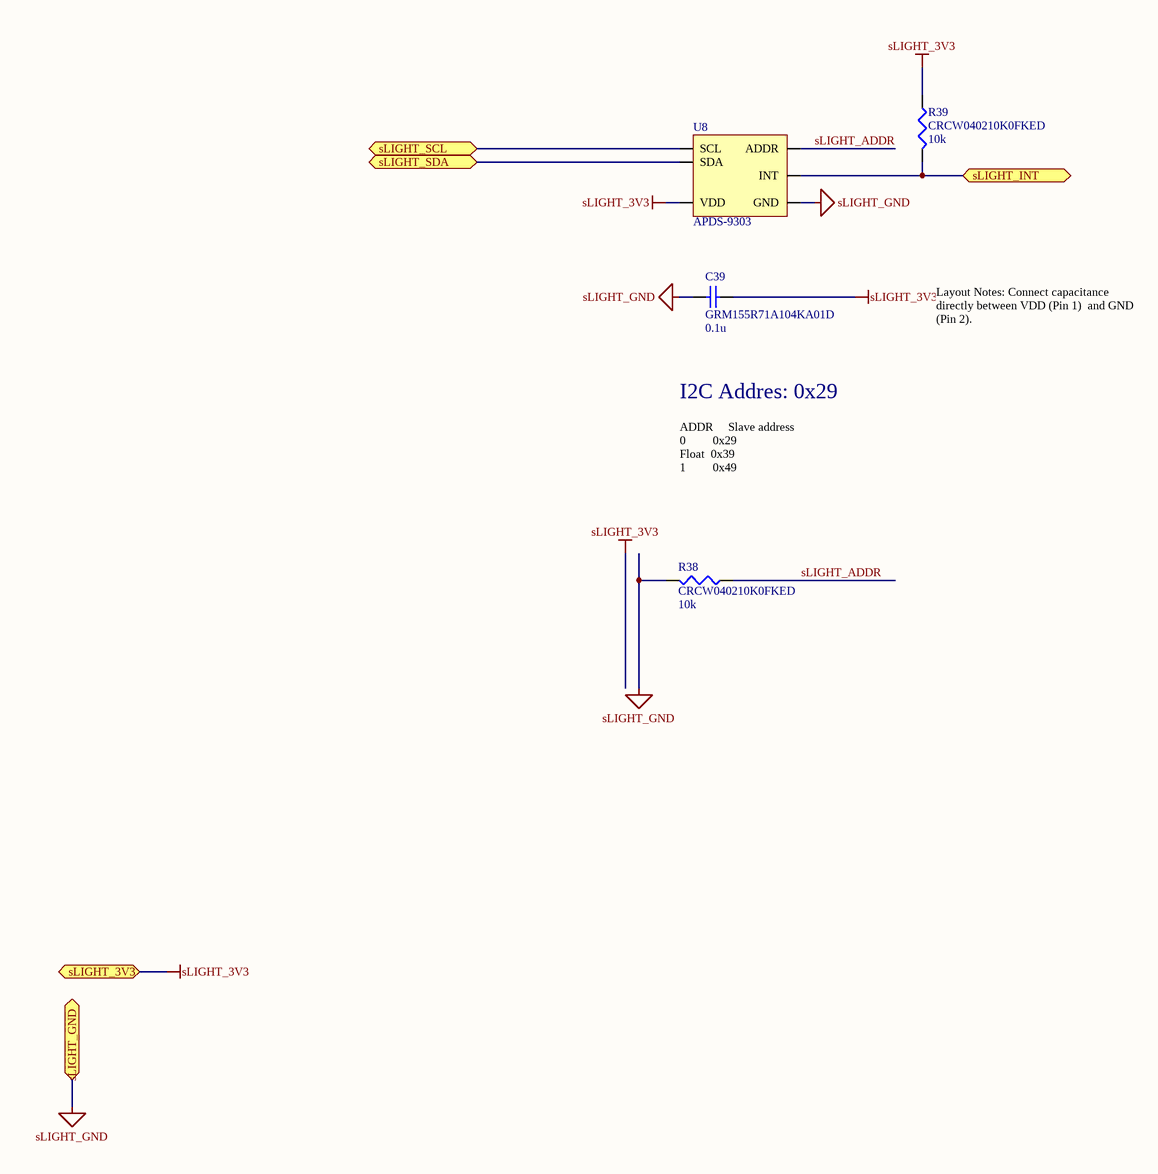
[diagram p8: _light.SchDoc]

### Parts
C39  GRM155R71A104KA01D  value 0.1u  [0402]
R38  CRCW040210K0FKED  value 10k  [0402]
R39  CRCW040210K0FKED  value 10k  [0402]
U8  APDS-9303  [APDS-9303]

### Ports
sLIGHT_3V3, sLIGHT_GND, sLIGHT_INT, sLIGHT_SCL, sLIGHT_SDA

### Nets
sLIGHT_3V3: C39.2 R39.1 U8.1(VDD) ; port sLIGHT_3V3  [project net sHUMID_3V3]
sLIGHT_GND: C39.1 R38.2 U8.2(GND) ; port sLIGHT_GND  [project net sHUMID_GND]
sLIGHT_ADDR: R38.1 U8.3(ADDR)
NetJ10_2: U8.4(SCL) ; port sLIGHT_SCL
NetJ10_3: R39.2 U8.6(INT) ; port sLIGHT_INT
NetJ10_4: U8.5(SDA) ; port sLIGHT_SDA

### Notes on the sheet
- Layout Notes: Connect capacitance directly between VDD (Pin 1)  and GND (Pin 2).
- I2C Addres: 0x29
- ADDR     Slave address
  0         0x29
  Float  0x39
  1         0x49

### Library data of the parts
C39 = GRM155R71AxxxKdddd: -55-125C, 1005, 10V, X7R, ±10%
R38 R39 = CRCW0402xxxxFKED: 0.125W, -55-155C, 1005, 50V, ±1%

## Sheet _humidity.SchDoc
size Tabloid
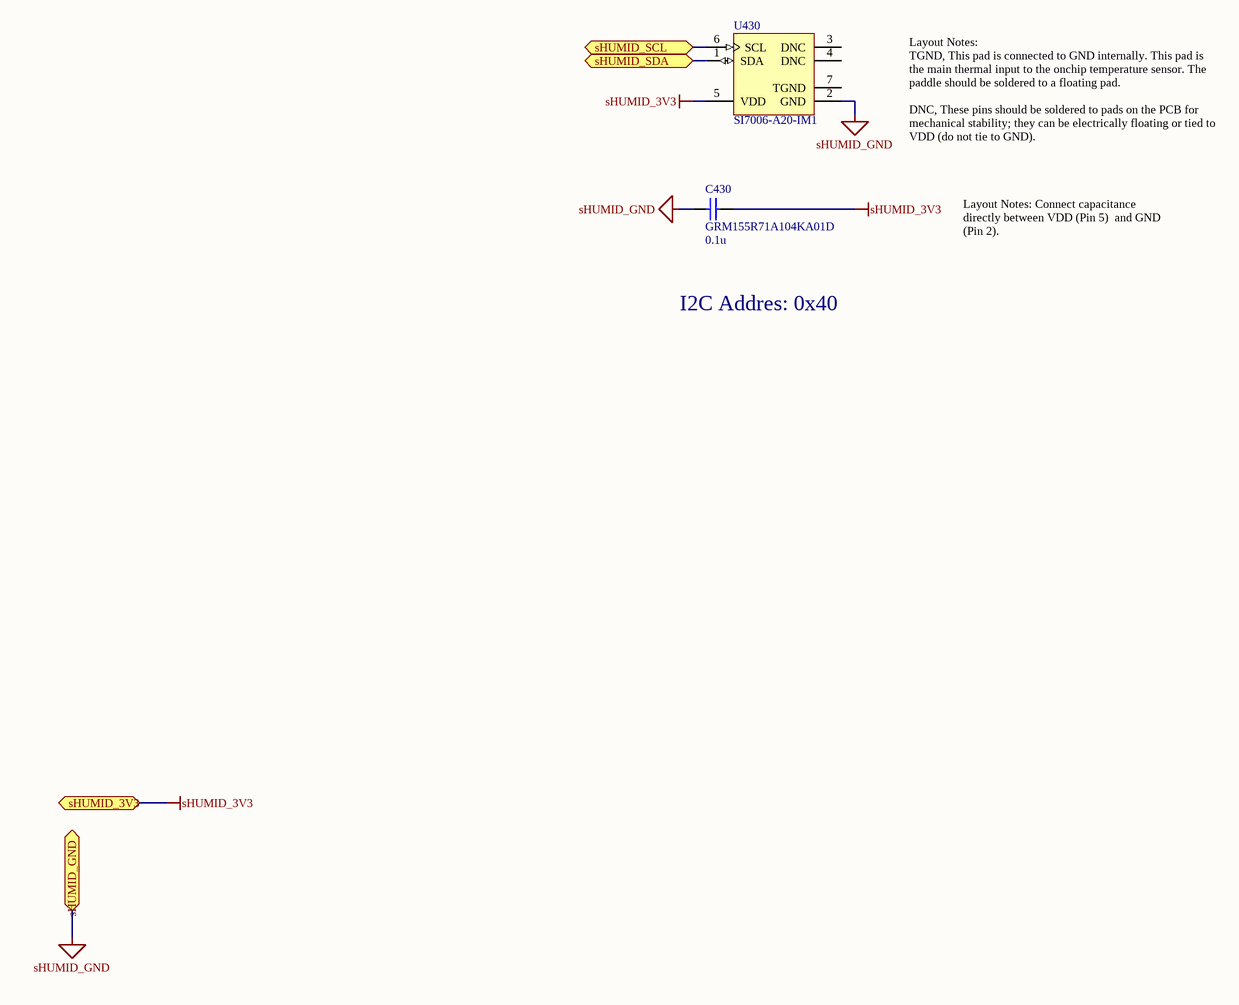
[diagram p9: _humidity.SchDoc]

### Parts
C430  GRM155R71A104KA01D  value 0.1u  [0402]
U430  SI7006-A20-IM1  [SLAB-DFN-6-1500X2400TP_V]

### Ports
sHUMID_3V3, sHUMID_GND, sHUMID_SCL, sHUMID_SDA

### Nets
sHUMID_3V3: C430.2 U430.5(VDD) ; port sHUMID_3V3
sHUMID_GND: C430.1 U430.2(GND) ; port sHUMID_GND
NetJ10_2: U430.6(SCL) ; port sHUMID_SCL
NetJ10_4: U430.1(SDA) ; port sHUMID_SDA

Not connected (* = marked no-connect by the designer): U430 3(DNC) 4(DNC) 7(TGND)

### Notes on the sheet
- Layout Notes:
  TGND, This pad is connected to GND internally. This pad is the main thermal input to the onchip temperature sensor. The paddle should be soldered to a floating pad.
  DNC, These pins should be soldered to pads on the PCB for mechanical stability; they can be electrically floating or tied to VDD (do not tie to GND).
- Layout Notes: Connect capacitance directly between VDD (Pin 5)  and GND (Pin 2).
- I2C Addres: 0x40

### Library data of the parts
C430 = GRM155R71AxxxKdddd: -55-125C, 1005, 10V, X7R, ±10%
U430 = CMP-2000-07060-1: I2C Humidity and Temperature Sensor, 1.9 to 3.6 V, -40 to 125 degC, 6-Pin DFN, RoHS, Tube; Manufacturer: Silicon Labs; Output Type: Digital; Resolution: 12(Humidity)bit,14(Temperature)bit; Minimum Operating Supply Voltage: 1.9V; Sensor Function: Temperature&Humidity; Accuracy: ±1°C,±5%RH; Maximum Operating Supply Voltage: 3.6V; Pin Count: 6; Maximum Operating Temperature: +125°C; Package Reference: DFN-6; Height: 0.75mm; Datasheet URL: https://www.silabs.com/Support%20Documents%2FTechnicalDocs%2FSi7006-A20.pdf; Datasheet Version: Rev. 1.1, 06/2015; Package Type: DFN; Mounting Technology: SurfaceMount; Dimensions: 3x3x0.75mm; Length: 3mm; Package Description: 6-Pin Small Outline No-Lead Package, Body 3 x 3 mm, Pitch 1 mm; Minimum Operating Temperature: -40°C; Interface Type: I2C; Mounting Type: SurfaceMount; Width: 3mm; Manufacturer URL: http://www.silabs.com/

## Sheet _io.SchDoc
size Tabloid
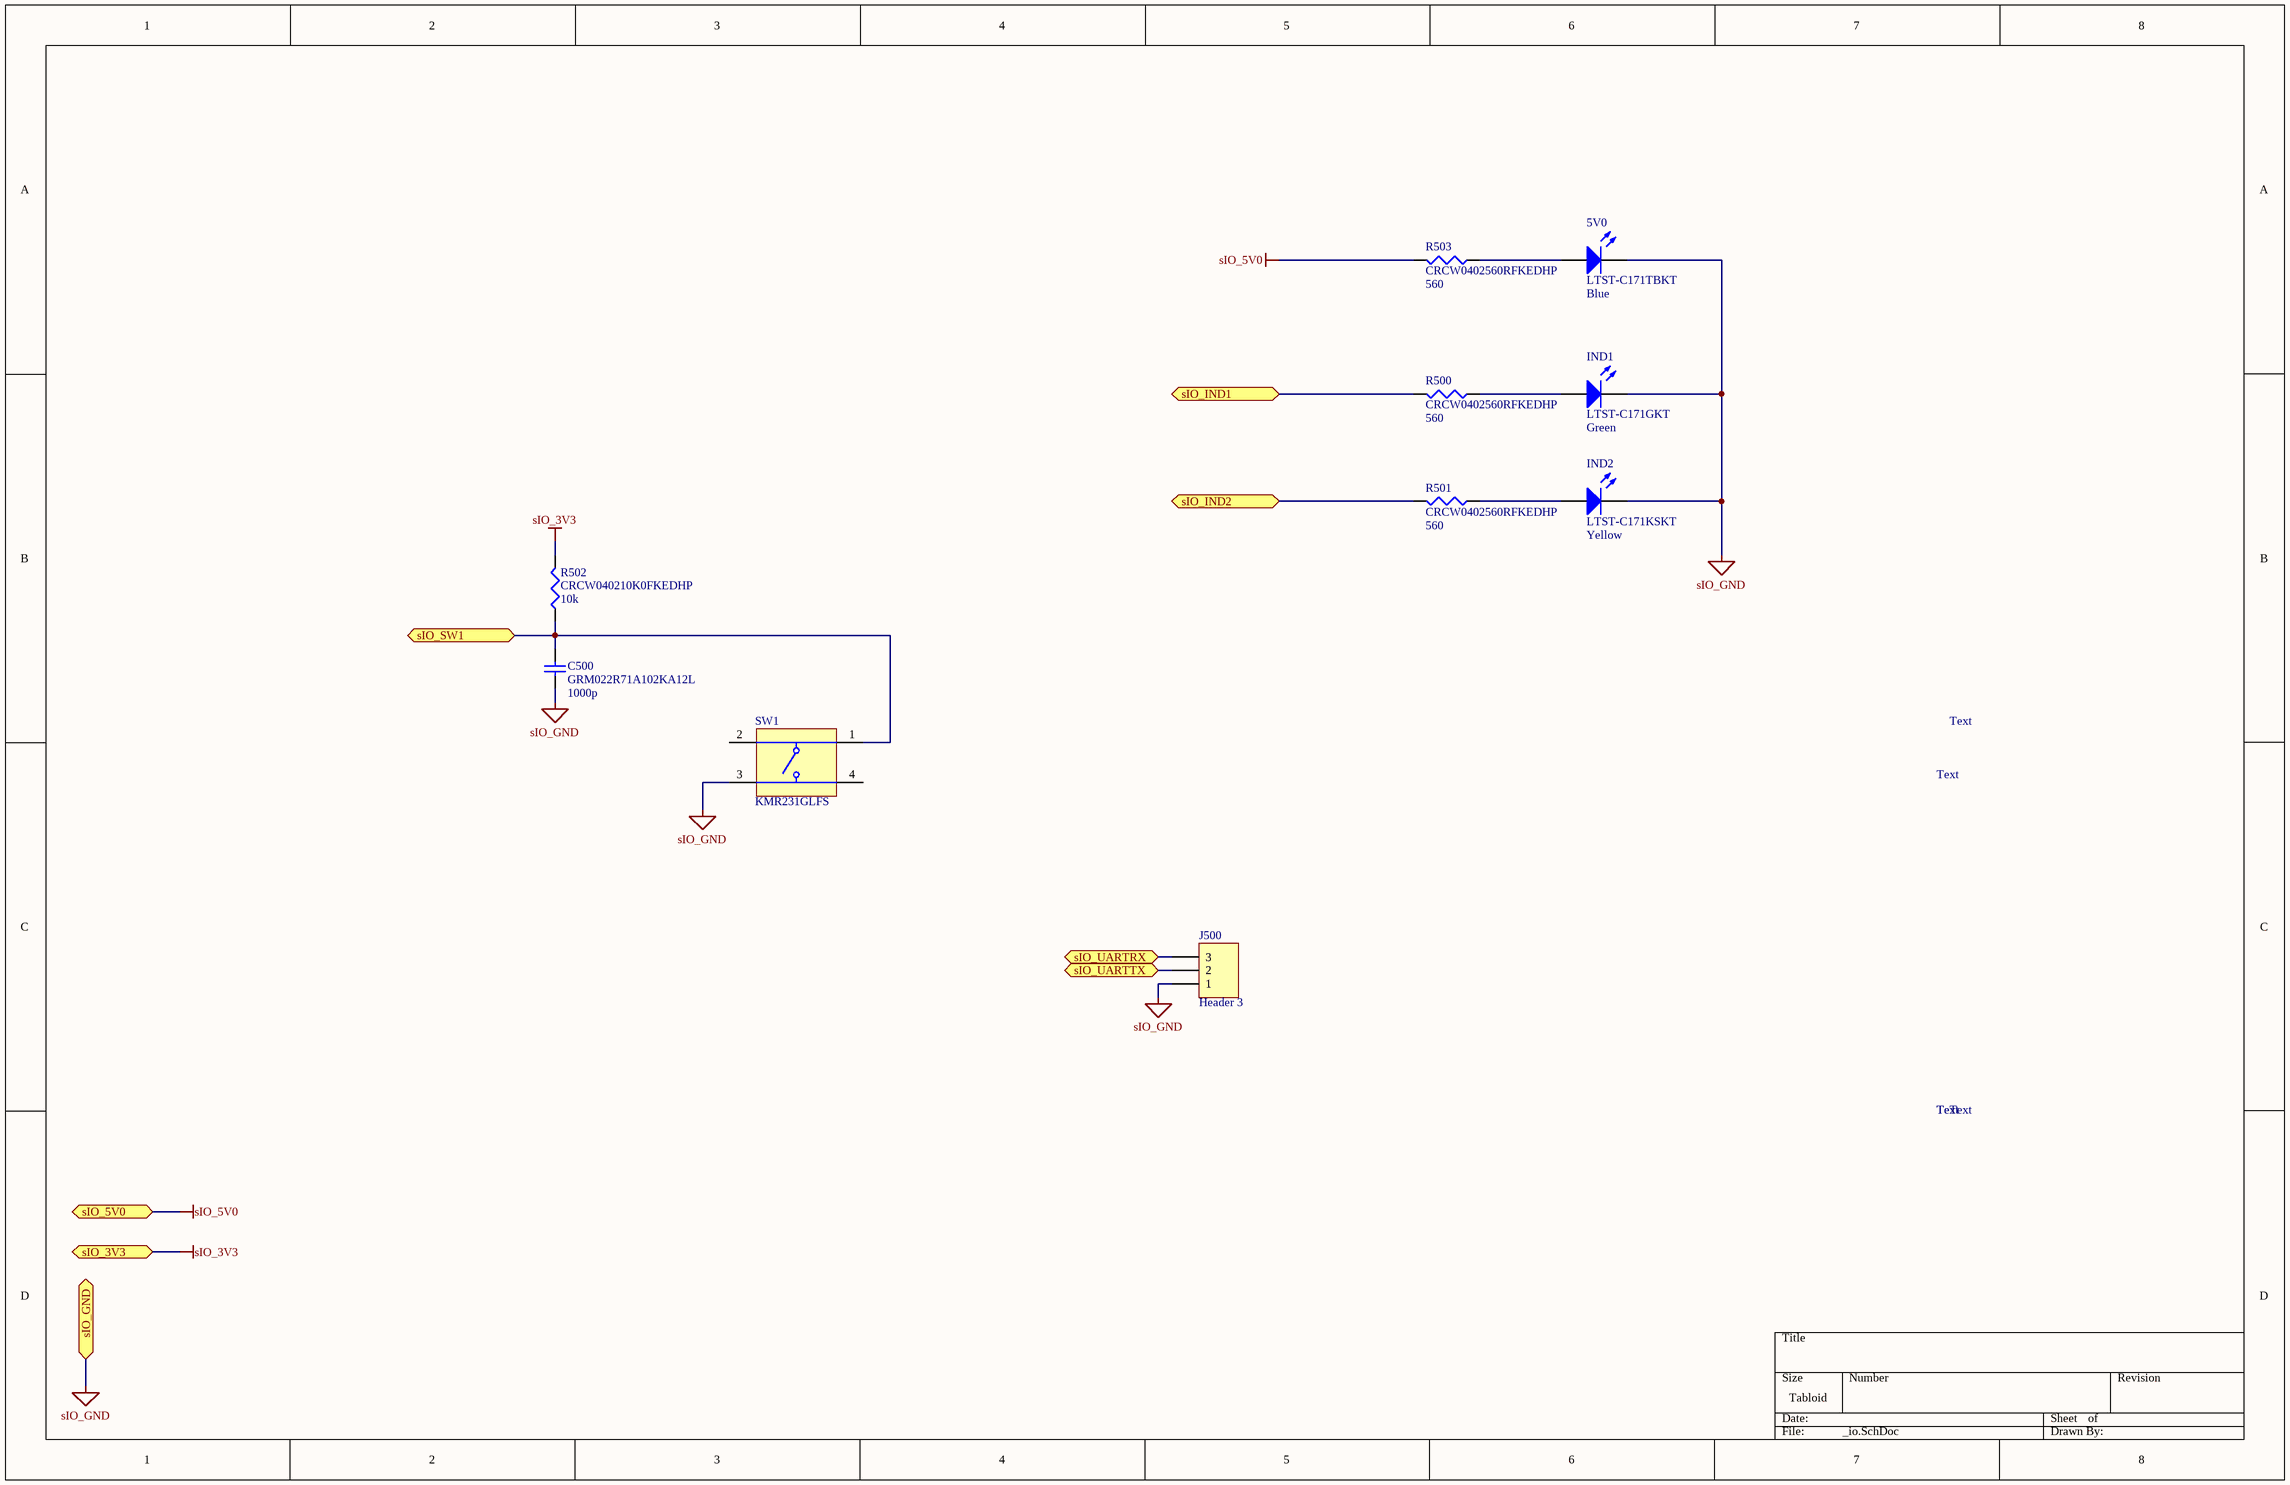
[diagram p10: _io.SchDoc]

### Parts
5V0  LTST-C171TBKT  Color: Blue  [0805]
C500  GRM022R71A102KA12L  value 1000p  [0402]
IND1  LTST-C171GKT  Color: Green  [0805]
IND2  LTST-C171KSKT  Color: Yellow  [0805]
J500  Header 3  [HDR1X3]
R500  CRCW0402560RFKEDHP  value 560  [0402]
R501  CRCW0402560RFKEDHP  value 560  [0402]
R502  CRCW040210K0FKEDHP  value 10k  [0402]
R503  CRCW0402560RFKEDHP  value 560  [0402]
SW1  KMR231GLFS  [CKCP-KMR231GLFS]

### Ports
sIO_3V3, sIO_5V0, sIO_GND, sIO_IND1, sIO_IND2, sIO_SW1, sIO_UARTRX, sIO_UARTTX

### Nets
sIO_3V3: R502.2 ; port sIO_3V3  [project net sPWR_3V3]
sIO_5V0: R503.2 ; port sIO_5V0  [project net sPWR_5V0]
sIO_GND: 5V0.2(K) C500.1 IND1.2(K) IND2.2(K) J500.1 SW1.3 ; port sIO_GND  [project net sGND]
A0/sIO_UARTRX: J500.2 ; port sIO_UARTTX
A1/sIO_UARTTX: J500.3 ; port sIO_UARTRX
C4/sIO_IND1: R500.2 ; port sIO_IND1
C5/sIO_IND2: R501.2 ; port sIO_IND2
C6/sIO_SW1: C500.2 R502.1 SW1.1 ; port sIO_SW1
Net5V0_1: 5V0.1(A) R503.1
NetIND1_1: IND1.1(A) R500.1
NetIND2_1: IND2.1(A) R501.1

Not connected (* = marked no-connect by the designer): SW1 2 4

### Notes on the sheet
- Text

### Library data of the parts
5V0 IND1 = LTST-C171GKT: LED
C500 = GRM022R71AxxxKdddd: -55-125C, 1005, 10V, X7R, ±10%
IND2 = LTST-C171KSKT: LED
J500 = Header 3: Header, 3-Pin; LatestRevisionDate: 17-Jul-2002; LatestRevisionNote: Re-released for DXP Platform.; Publisher: Altium Limited
R500-R503 = CRCW0402xxxxFKED: 0.125W, -55-155C, 1005, 50V, ±1%
SW1 = CMP-2000-06516-1: as RESET on sheet _microcontroller; Operating Temperature: -40to85C; Electrical Life: N/A; Housing Material: N/A; ECCN: EAR99; Pole Throw Configuration: SPST; Contact Plating: Silver; Dimension: 2.8x4.6x1.9mm; Type: Micro-Miniature; Product Weight: N/A; Package Description: 4-Pin Surface Mount Device, Body 4.6 x 2.8 mm; Actuator Color: N/A; HTS: 8536501199; Mounting Technology: SurfaceMount; Mounting: SurfaceMount,GullWing; Seal Location: N/A; Base Material: N/A; Family: KMR2; Part No: KMR231GLFS; Datasheet Version: 06/2016; Contact Material: Silver; Package Reference: KMR231GLFS; Manufacturer URL: http://www.ckswitches.com/; Maximum AC Voltage Rating: N/A; Datasheet URL: http://www.ck-components.com/media/1479/kmr2.pdf; RoHS: Yes; Seal Description: N/A; Packaging: TapeandReel; Supplier: C&KComponents

## Sheet _microsd.SchDoc
size Tabloid
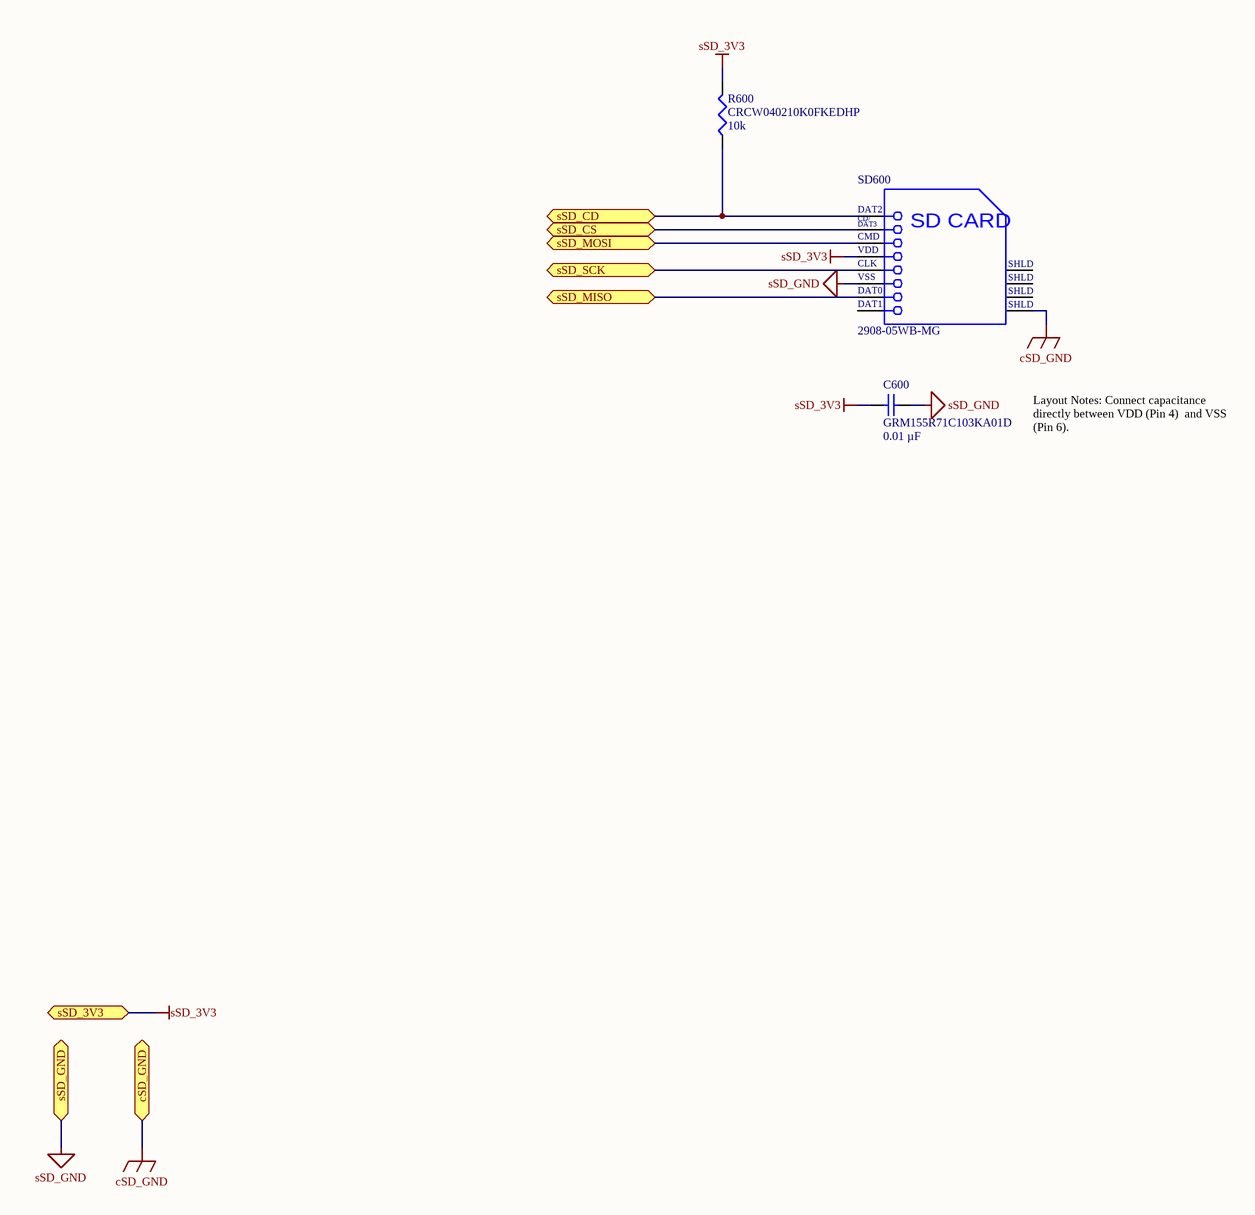
[diagram p11: _microsd.SchDoc]

### Parts
C600  GRM155R71C103KA01D  value 0.01 µF  [0402]
R600  CRCW040210K0FKEDHP  value 10k  [0402]
SD600  2908-05WB-MG  [3M-2908-05WB-MG_V]

### Ports
cSD_GND, sSD_3V3, sSD_CD, sSD_CS, sSD_GND, sSD_MISO, sSD_MOSI, sSD_SCK

### Nets
cSD_GND: SD600.12(SHLD) ; port cSD_GND
sSD_3V3: C600.2 R600.2 SD600.4(VDD) ; port sSD_3V3
sSD_GND: C600.1 SD600.6(VSS) ; port sSD_GND
NetR600_1: R600.1 SD600.1(DAT2) ; port sSD_CD
NetSD600_2: SD600.2(CD/DAT3) ; port sSD_CS
NetSD600_3: SD600.3(CMD) ; port sSD_MOSI
NetSD600_5: SD600.5(CLK) ; port sSD_SCK
NetSD600_7: SD600.7(DAT0) ; port sSD_MISO

Not connected (* = marked no-connect by the designer): SD600 8(DAT1) 9(SHLD) 10(SHLD) 11(SHLD)

### Notes on the sheet
- Layout Notes: Connect capacitance directly between VDD (Pin 4)  and VSS (Pin 6).
- (in symbol CMP-2000-05030-1) CD/; DAT3; SD CARD

### Library data of the parts
C600 = Cap: Cap, 0.01 µF, 16 V, X7R; Published: 8-Jun-2000; LatestRevisionDate: 17-Jul-2002; LatestRevisionNote: Re-released for DXP Platform.; PackageReference: RAD-0.3; Publisher: Altium Limited; PackageDescription: Radial Cap, Thru-Hole; 2 Leads; 0.3 in Pin Spacing
R600 = CRCW0402xxxxFKED: 0.125W, -55-155C, 1005, 50V, ±1%
SD600 = CMP-2000-05030-1: Card Connector Micro-SD, 500 VAC, 100 mOhm Min, 0.5 A, RoHS, Tape and Reel; Manufacturer: 3M; Connector Type: ConnectorandEjector; Other Related Documents: SDCardDateCodeDecipher; Insertion, Removal Method: PushIn,PushOut; Other Names: 3M5607CT; PCN Obsolescence/ EOL: 2908Series30/Jun/2010; Number of Positions: 10(8+2); Card Type: SecureDigital-microSD™; Online Catalog: 2900Series; Featured Product: 3MCardConnectormicroSD; Features: Switch; Packaging: CutTape(CT); Package Reference: 2908-05WB-MG; Package Description: 8-Pin Surface Mount Device, Body 15.2 x 14 mm, Pitch 1.1 mm; Contact Finish: Gold; Catalog Drawings: 2908-05WB-MG; Mounting Feature: Normal,Standard-Top; Series: 2900; Datasheet Version: Oct-06; Datasheet URL: http://datasheet.octopart.com/2908-05WB-MG-3M-datasheet-6398107.pdf; Contact Finish Thickness: 15µin(0.38µm); Manufacturer URL: http://www.3m.com/; Family: MemoryConnectors-PCCardSockets; Category: Connectors,Interconnects; Standard Package: 1; Mounting Type: SurfaceMount,RightAngle; Ejector Side: -

## Nets that join several sheets
sGND: _microcontroller (30 pins), _power (24 pins), _accel_mag (11 pins), _gyroscope (19 pins), _i2c1 (J5.5 J6.5 J7.5), _io (6 pins)
sHUMID_3V3: _i2c1 (J10.6), _light (C39.2 R39.1 U8.1), _humidity (C430.2 U430.5)
sHUMID_GND: _i2c1 (J10.5), _light (C39.1 R38.2 U8.2), _humidity (C430.1 U430.2)
sPWR_3V3: _microcontroller (16 pins), _power (8 pins), _i2c0 (R21.2 R23.2), _accel_mag (8 pins), _gyroscope (7 pins), _i2c1 (5 pins), _io (R502.2)
sPWR_3V7: _microcontroller (R102.1 R106.2), _power (5 pins)
sPWR_5V0: _microcontroller (U100.46), _power (6 pins), _io (R503.2)
sTEMP_3V3: _i2c1 (J8.6), I2C 1/Temperature (C37_Temperature2.2 R34_Temperature2.2 R36_Temperature2.1 U9_Temperature2.5)
sTEMP_3V3: _i2c1 (J9.6), I2C 1/Temperature (C37_Temperature1.2 R34_Temperature1.2 R36_Temperature1.1 U9_Temperature1.5)
sTEMP_GND: _i2c1 (J8.5), I2C 1/Temperature (C37_Temperature2.1 U9_Temperature2.2)
sTEMP_GND: _i2c1 (J9.5), I2C 1/Temperature (C37_Temperature1.1 U9_Temperature1.2)
A0/sIO_UARTRX: _microcontroller (U100.17), _io (J500.2)
A1/sIO_UARTTX: _microcontroller (U100.18), _io (J500.3)
A6/sI2C1_SCL: _microcontroller (U100.23), _i2c1 (J5.2 J6.2 J7.2 R27.1)
A7/sI2C1_SDA: _microcontroller (U100.24), _i2c1 (J5.4 J6.4 J7.4 R28.1)
B2/sI2C0_SCL: _microcontroller (U100.47), _i2c0 (R21.1), _accel_mag (U310.4), _gyroscope (U320.11)
B3/sI2C0_SDA: _microcontroller (U100.48), _i2c0 (R23.1), _accel_mag (U310.6), _gyroscope (U320.12)
C4/sIO_IND1: _microcontroller (U100.16), _io (R500.2)
C5/sIO_IND2: _microcontroller (U100.15), _io (R501.2)
C6/sIO_SW1: _microcontroller (U100.14), _io (C500.2 R502.1 SW1.1)
D0/sBMS_MODE: _microcontroller (U100.61), _power (R9.2 U2.3)
D1/sTEMP_ALERT_R: _microcontroller (U100.62), _i2c1 (J7.3)
D2/sLIGHT_INT_M: _microcontroller (U100.63), _i2c1 (J6.3)
D3/sTEMP_ALERT_L: _microcontroller (U100.64), _i2c1 (J5.3)
D4/sUSB_DATA_N: _microcontroller (U100.43), _power (R3.2)
D5/sUSB_DATA_P: _microcontroller (U100.44), _power (R4.2)
E0/sBMS_~{SHDN}: _microcontroller (U100.9), _power (U3.8)
E1/sBMS_~{CHRG}: _microcontroller (U100.8), _power (R19.2 U3.1)
E2/sBMS_~{ACPR}: _microcontroller (U100.7), _power (R18.2 U3.10)
E3/sBMS~{_FAULT}: _microcontroller (U100.6), _power (R16.2 U3.3)
F1/sAG_INT1: _microcontroller (U100.29), _accel_mag (R311.2 U310.11)
F2/sAG_INT2: _microcontroller (U100.30), _accel_mag (R310.2 U310.9)
F3/sGYRO_INT1: _microcontroller (U100.31), _gyroscope (U320.3)
F4/sGYRO_INT2: _microcontroller (U100.5), _gyroscope (U320.2)
NetJ8_2: _i2c1 (J8.2), I2C 1/Temperature (U9_Temperature2.1)
NetJ8_3: _i2c1 (J8.3), I2C 1/Temperature (R36_Temperature2.2 U9_Temperature2.3)
NetJ8_4: _i2c1 (J8.4), I2C 1/Temperature (U9_Temperature2.6)
NetJ9_2: _i2c1 (J9.2), I2C 1/Temperature (U9_Temperature1.1)
NetJ9_3: _i2c1 (J9.3), I2C 1/Temperature (R36_Temperature1.2 U9_Temperature1.3)
NetJ9_4: _i2c1 (J9.4), I2C 1/Temperature (U9_Temperature1.6)
NetJ10_2: _i2c1 (J10.2), _light (U8.4), _humidity (U430.6)
NetJ10_3: _i2c1 (J10.3), _light (R39.2 U8.6)
NetJ10_4: _i2c1 (J10.4), _light (U8.5), _humidity (U430.1)
s~{HIB}: _microcontroller (U100.33), _power (U1.6)